# Altium project SoM-STM32F4.PrjPcb
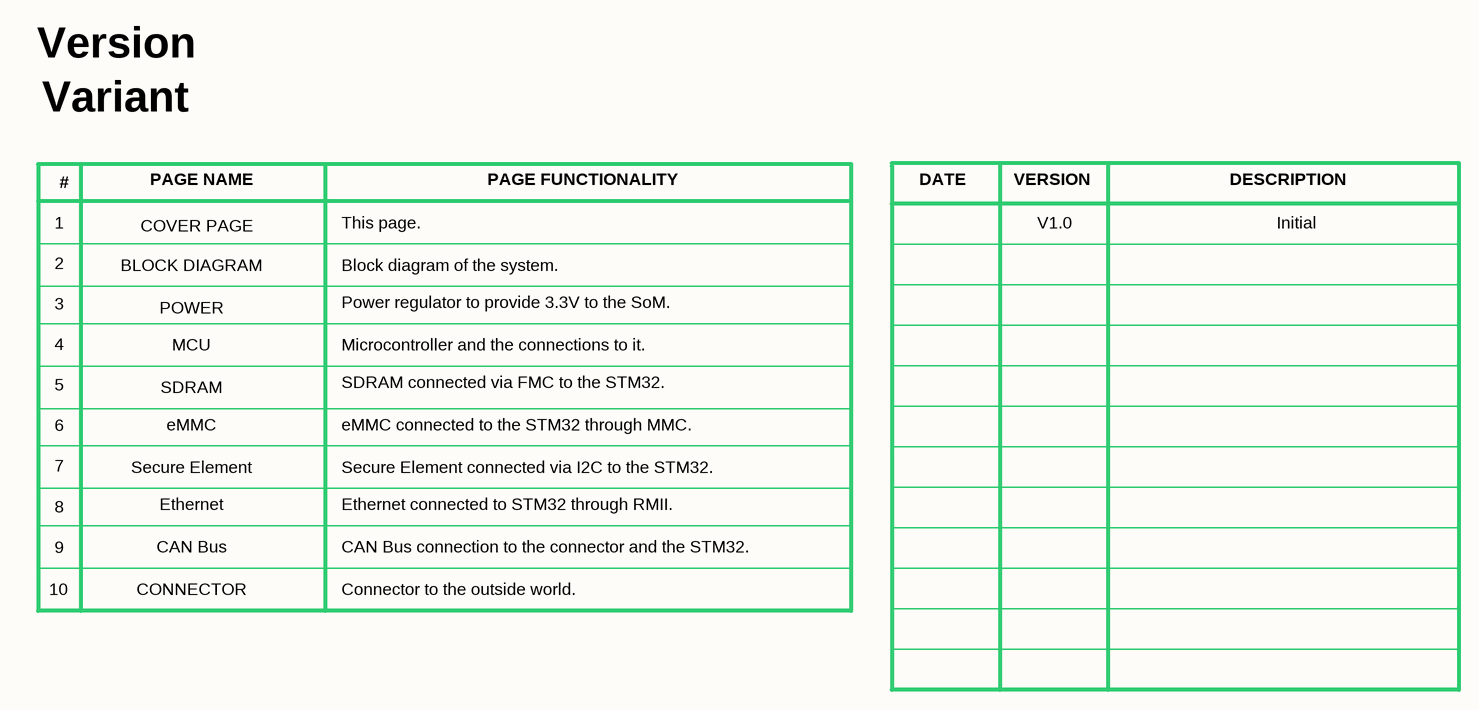
[diagram p0: 01 COVER PAGE.SchDoc]
Engineer_Email: contact@silardgal.com; Engineer_Link: https://www.silardgal.com; Engineer_Name: Silard Gal; Global_version: 1.0
10 sheets, 104 parts. Net scope: flat (ports and power ports of the same name join across sheets).
Board file: SoM-STM32F4.PcbDoc
Sheets:
  01 COVER PAGE.SchDoc
  02 BLOCK DIAGRAM.SchDoc
    U_05 SDRAM = 05 SDRAM.SchDoc
    U_06 eMMC = 06 eMMC.SchDoc
    U_07 Secure Element = 07 Secure Element.SchDoc
    U_9 CAN Bus = 09 CAN Bus.SchDoc
    U_08 Ethernet = 08 Ethernet.SchDoc
    U_04 MCU = 04 MCU.SchDoc
    U_10 CONNECTOR = 10 CONNECTOR.SchDoc
  03 POWER.SchDoc

## Sheet 01 COVER PAGE.SchDoc: COVER PAGE
size 420 x 297 mm; SheetNumber: 1; SheetTotal: 10

### Notes on the sheet
- Version
- Variant
- 1
- #
- PAGE NAME
- COVER PAGE
- This page.
- PAGE FUNCTIONALITY
- DATE
- VERSION
- V1.0
- DESCRIPTION
- Initial
- 2
- BLOCK DIAGRAM
- POWER
- Block diagram of the system.
- Power regulator to provide 3.3V to the SoM.
- 3
- 4
- MCU
- Microcontroller and the connections to it.
- 5
- 6
- SDRAM
- eMMC
- SDRAM connected via FMC to the STM32.
- eMMC connected to the STM32 through MMC.
- 7
- Secure Element
- Ethernet
- Secure Element connected via I2C to the STM32.
- Ethernet connected to STM32 through RMII.
- 8
- 9
- CAN Bus
- CAN Bus connection to the connector and the STM32.
- 10
- CONNECTOR
- Connector to the outside world.
- Title
- Project
- Size
- Date
- Revision
- A3
- Designed By

## Sheet 02 BLOCK DIAGRAM.SchDoc: BLOCK DIAGRAM
size 420 x 297 mm; SheetNumber: 2; SheetTotal: 10
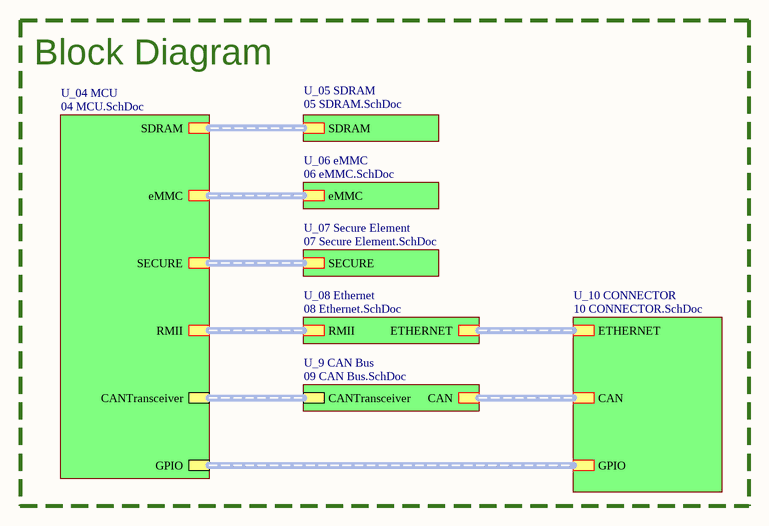
[diagram p1: 02 BLOCK DIAGRAM.SchDoc]

### Sub-sheets
U_04 MCU = 04 MCU.SchDoc: SDRAM (harness SDRAM), eMMC (harness eMMC), SECURE (harness SECURE ELEMENT), RMII (harness RMII), CANTransceiver (harness CAN), GPIO (harness GPIO)
U_05 SDRAM = 05 SDRAM.SchDoc: SDRAM (harness SDRAM)
U_06 eMMC = 06 eMMC.SchDoc: eMMC (harness eMMC)
U_07 Secure Element = 07 Secure Element.SchDoc: SECURE (harness SECURE ELEMENT)
U_08 Ethernet = 08 Ethernet.SchDoc: ETHERNET (harness ETHERNET), RMII (harness RMII)
U_9 CAN Bus = 09 CAN Bus.SchDoc: CAN (harness CAN Bus), CANTransceiver (harness CAN)
U_10 CONNECTOR = 10 CONNECTOR.SchDoc: ETHERNET (harness ETHERNET), CAN (harness CAN Bus), GPIO (harness GPIO)

### Buses and harness runs
harness sheet U_04 MCU/CANTransceiver = sheet U_9 CAN Bus/CANTransceiver
harness sheet U_04 MCU/eMMC = sheet U_06 eMMC/eMMC
harness sheet U_04 MCU/GPIO = sheet U_10 CONNECTOR/GPIO
harness sheet U_04 MCU/RMII = sheet U_08 Ethernet/RMII
harness sheet U_04 MCU/SDRAM = sheet U_05 SDRAM/SDRAM
harness sheet U_04 MCU/SECURE = sheet U_07 Secure Element/SECURE
harness sheet U_08 Ethernet/ETHERNET = sheet U_10 CONNECTOR/ETHERNET
harness sheet U_9 CAN Bus/CAN = sheet U_10 CONNECTOR/CAN

### Notes on the sheet
- Block Diagram
- Title
- Project
- Size
- Date
- Revision
- A3
- Designed By

## Sheet 05 SDRAM.SchDoc: SDRAM
size 420 x 297 mm; SheetNumber: 4; SheetTotal: 10
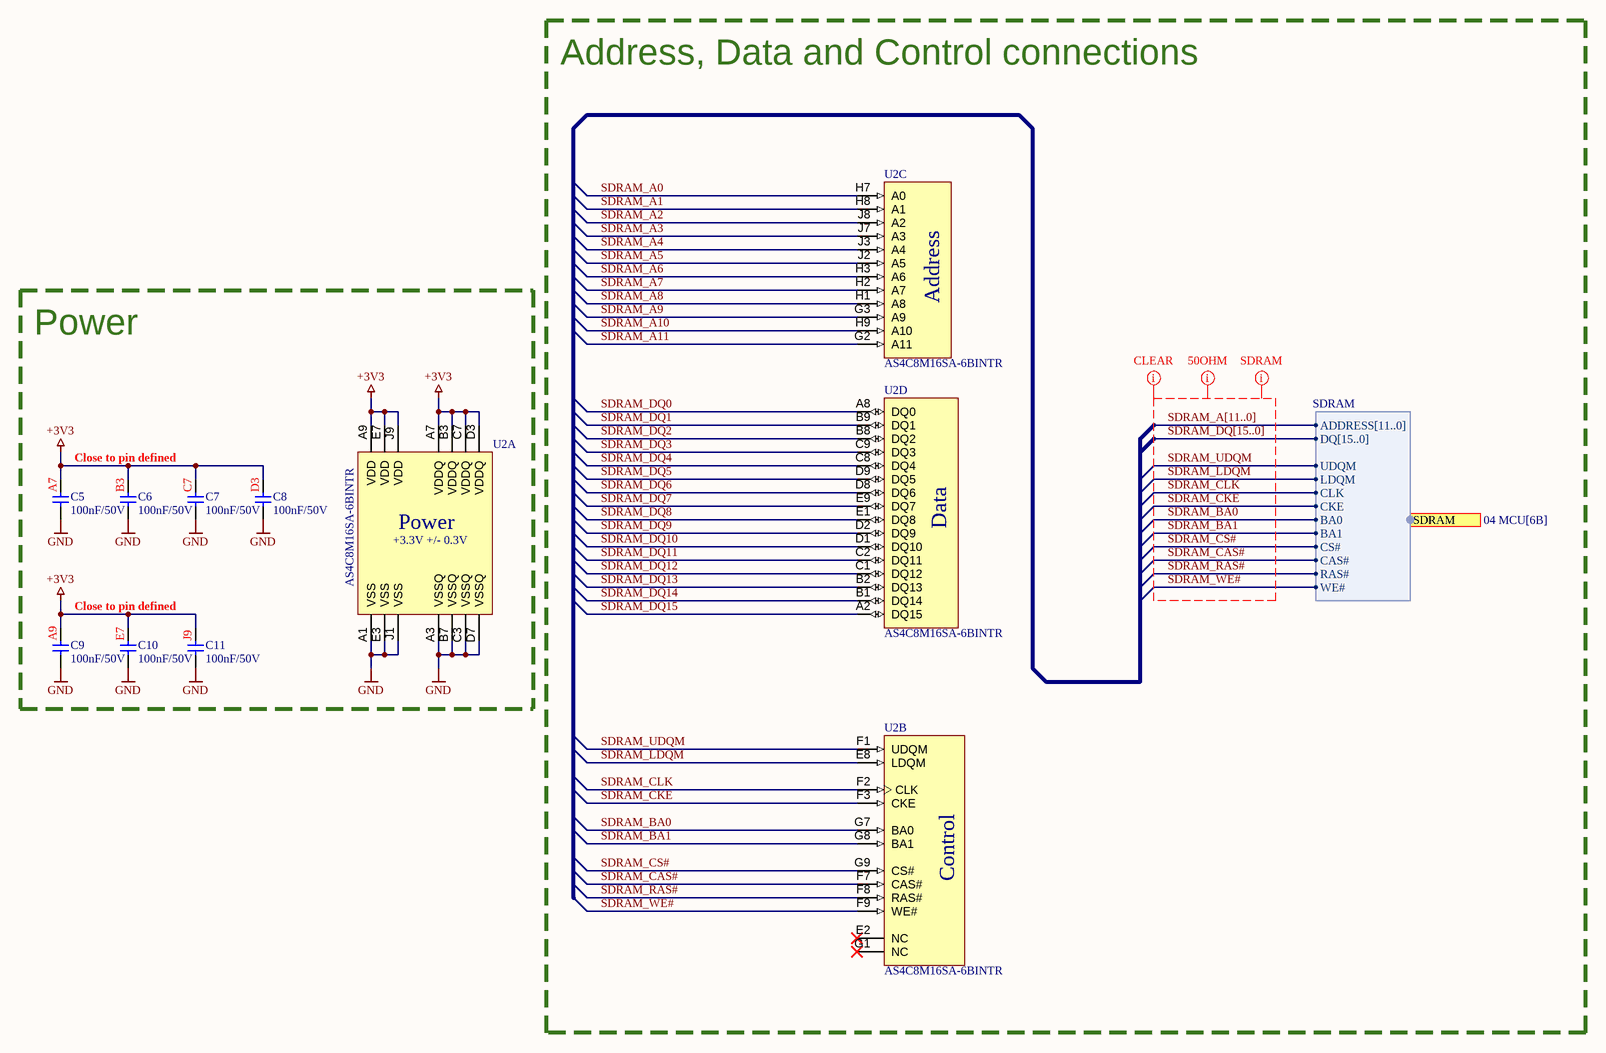
[diagram p2: 05 SDRAM.SchDoc]

### Parts
C5  100nF/50V  [CAPC1005X06M-0402]
C6  100nF/50V  [CAPC1005X06M-0402]
C7  100nF/50V  [CAPC1005X06M-0402]
C8  100nF/50V  [CAPC1005X06M-0402]
C9  100nF/50V  [CAPC1005X06M-0402]
C10  100nF/50V  [CAPC1005X06M-0402]
C11  100nF/50V  [CAPC1005X06M-0402]
U2  AS4C8M16SA-6BINTR  [TFBGA-54]  (parts A,B,C,D of 4)

### Blocks framed on the sheet
Address, Data and Control connections: U2
Power: C5-C11 U2

### Ports
SDRAM (harness SDRAM, see 04 MCU[6B])

### Harnesses
SDRAM: ADDRESS[11..0], DQ[15..0], UDQM, LDQM, CLK, CKE, BA0, BA1, CS#, CAS#, RAS#, WE#

### Nets
+3V3: C5.2 C6.2 C7.2 C8.2 C9.2 C10.2 C11.2 U2.A7(VDDQ) U2.A9(VDD) U2.B3(VDDQ) U2.C7(VDDQ) U2.D3(VDDQ) U2.E7(VDD) U2.J9(VDD)
GND: C5.1 C6.1 C7.1 C8.1 C9.1 C10.1 C11.1 U2.A1(VSS) U2.A3(VSSQ) U2.B7(VSSQ) U2.C3(VSSQ) U2.D7(VSSQ) U2.E3(VSS) U2.J1(VSS)
SDRAM_A0: U2.H7(A0)  [project net FMC_A0]
SDRAM_A1: U2.H8(A1)  [project net FMC_A1]
SDRAM_A2: U2.J8(A2)  [project net FMC_A2]
SDRAM_A3: U2.J7(A3)  [project net FMC_A3]
SDRAM_A4: U2.J3(A4)  [project net FMC_A4]
SDRAM_A5: U2.J2(A5)  [project net FMC_A5]
SDRAM_A6: U2.H3(A6)  [project net FMC_A6]
SDRAM_A7: U2.H2(A7)  [project net FMC_A7]
SDRAM_A8: U2.H1(A8)  [project net FMC_A8]
SDRAM_A9: U2.G3(A9)  [project net FMC_A9]
SDRAM_A10: U2.H9(A10)  [project net FMC_A10]
SDRAM_A11: U2.G2(A11)  [project net FMC_A11]
SDRAM_BA0: U2.G7(BA0) ; port SDRAM.BA0  [project net FMC_A14]
SDRAM_BA1: U2.G8(BA1) ; port SDRAM.BA1  [project net FMC_A15]
SDRAM_CAS#: U2.F7(CAS#) ; port SDRAM.CAS#  [project net FMC_SDNCAS]
SDRAM_CKE: U2.F3(CKE) ; port SDRAM.CKE  [project net FMC_SDCKE0]
SDRAM_CLK: U2.F2(CLK) ; port SDRAM.CLK  [project net FMC_SDCLK]
SDRAM_CS#: U2.G9(CS#) ; port SDRAM.CS#  [project net FMC_SDNE0]
SDRAM_DQ0: U2.A8(DQ0)  [project net FMC_D0]
SDRAM_DQ1: U2.B9(DQ1)  [project net FMC_D1]
SDRAM_DQ2: U2.B8(DQ2)  [project net FMC_D2]
SDRAM_DQ3: U2.C9(DQ3)  [project net FMC_D3]
SDRAM_DQ4: U2.C8(DQ4)  [project net FMC_D4]
SDRAM_DQ5: U2.D9(DQ5)  [project net FMC_D5]
SDRAM_DQ6: U2.D8(DQ6)  [project net FMC_D6]
SDRAM_DQ7: U2.E9(DQ7)  [project net FMC_D7]
SDRAM_DQ8: U2.E1(DQ8)  [project net FMC_D8]
SDRAM_DQ9: U2.D2(DQ9)  [project net FMC_D9]
SDRAM_DQ10: U2.D1(DQ10)  [project net FMC_D10]
SDRAM_DQ11: U2.C2(DQ11)  [project net FMC_D11]
SDRAM_DQ12: U2.C1(DQ12)  [project net FMC_D12]
SDRAM_DQ13: U2.B2(DQ13)  [project net FMC_D13]
SDRAM_DQ14: U2.B1(DQ14)  [project net FMC_D14]
SDRAM_DQ15: U2.A2(DQ15)  [project net FMC_D15]
SDRAM_LDQM: U2.E8(LDQM) ; port SDRAM.LDQM  [project net FMC_NBL0]
SDRAM_RAS#: U2.F8(RAS#) ; port SDRAM.RAS#  [project net FMC_SDNRAS]
SDRAM_UDQM: U2.F1(UDQM) ; port SDRAM.UDQM  [project net FMC_NBL1]
SDRAM_WE#: U2.F9(WE#) ; port SDRAM.WE#  [project net FMC_SDNWE]

Not connected (* = marked no-connect by the designer): U2 E2(NC)* G1(NC)*

### Buses and harness runs
bus SDRAM_A[11..0]
bus SDRAM_DQ[15..0]

### Layout directives
net class SDRAM: SDRAM_A[11..0], SDRAM_BA0, SDRAM_BA1, SDRAM_CAS#, SDRAM_CKE, SDRAM_CLK, SDRAM_CS#, SDRAM_DQ[15..0], SDRAM_LDQM, SDRAM_RAS#, SDRAM_UDQM, SDRAM_WE#
net class 50OHM: SDRAM_A[11..0], SDRAM_BA0, SDRAM_BA1, SDRAM_CAS#, SDRAM_CKE, SDRAM_CLK, SDRAM_CS#, SDRAM_DQ[15..0], SDRAM_LDQM, SDRAM_RAS#, SDRAM_UDQM, SDRAM_WE#
net class CLEAR: SDRAM_A[11..0], SDRAM_BA0, SDRAM_BA1, SDRAM_CAS#, SDRAM_CKE, SDRAM_CLK, SDRAM_CS#, SDRAM_DQ[15..0], SDRAM_LDQM, SDRAM_RAS#, SDRAM_UDQM, SDRAM_WE#

### Notes on the sheet
- (near C5) A7
- Close to pin defined
- (near C6) B3
- (near C7) C7
- (near C8) D3
- (near C9) A9
- (near C10) E7
- (near C11) J9
- Title
- Project
- Size
- Date
- Revision
- A3
- Designed By
- (in symbol AS4C8M16SA-6BINTR, part A) Power; +3.3V +/- 0.3V
- (in symbol AS4C8M16SA-6BINTR, part B) Control
- (in symbol AS4C8M16SA-6BINTR, part C) Address
- (in symbol AS4C8M16SA-6BINTR, part D) Data

### Library data of the parts
C5-C11 = GRM155R71H104KE14D: 0.1 µF ±10% 50V Ceramic Capacitor X7R 0402 (1005 Metric); ComponentLink1Description: Datasheet; ComponentLink1URL: https://search.murata.co.jp/Ceramy/image/img/A01X/G101/ENG/GRM155R60J475ME47-01.pdf; MPN: GRM155R71H104KE14D
U2 = AS4C8M16SA-6BINTR: SDRAM Memory IC 128Mbit Parallel 166 MHz 5 ns 54-TFBGA (8x8); MPN: AS4C8M16SA-6BINTR; ComponentLink1Description: Datasheet; ComponentLink1URL: https://www.alliancememory.com/wp-content/uploads/pdf/dram/128M-AS4C8M16SA.pdf

## Sheet 06 eMMC.SchDoc: eMMC
size 420 x 297 mm; SheetNumber: 6; SheetTotal: 10
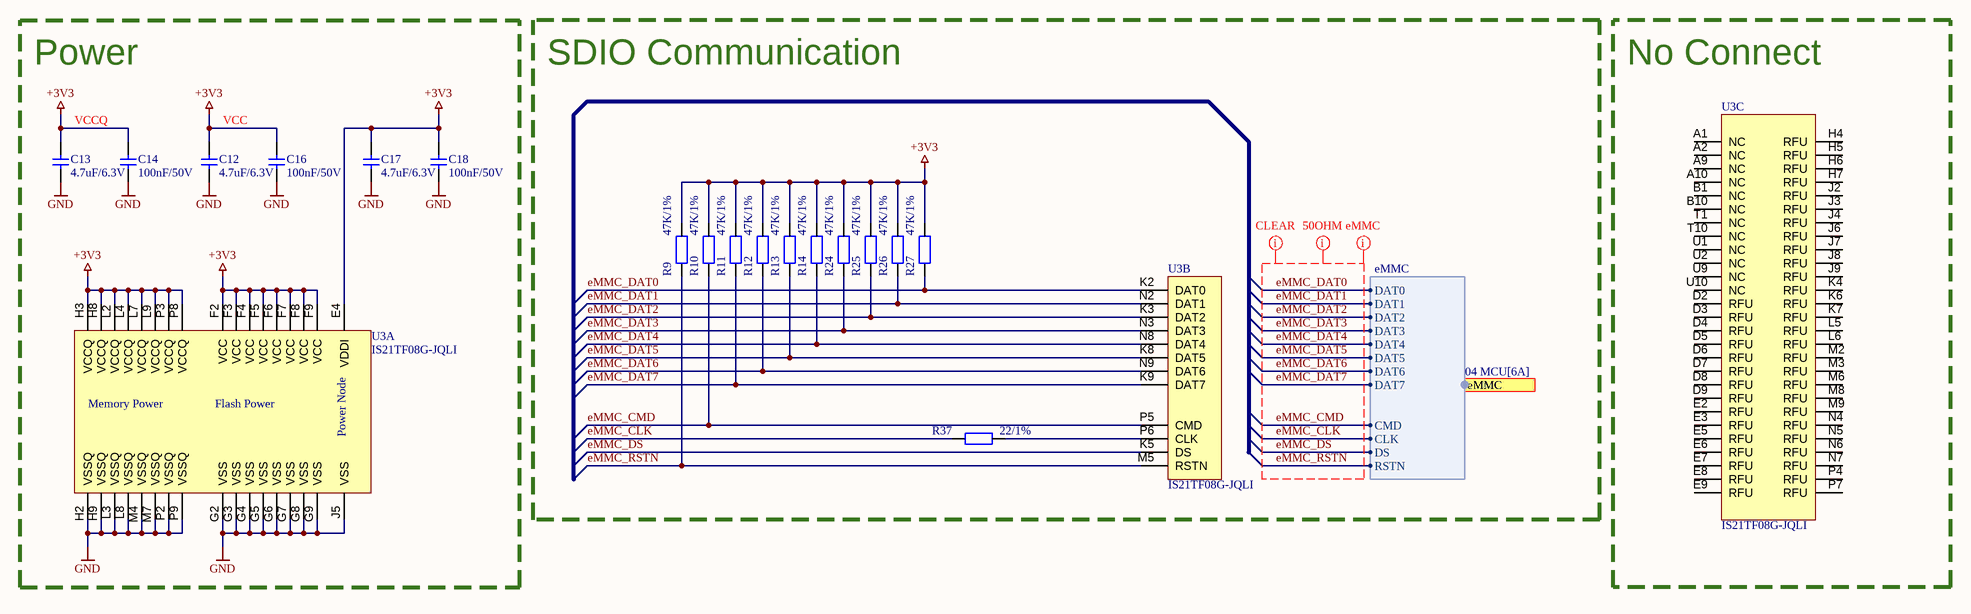
[diagram p3: 06 eMMC.SchDoc]

### Parts
C12  4.7uF/6.3V  [CAPC1005X06M-0402]
C13  4.7uF/6.3V  [CAPC1005X06M-0402]
C14  100nF/50V  [CAPC1005X06M-0402]
C16  100nF/50V  [CAPC1005X06M-0402]
C17  4.7uF/6.3V  [CAPC1005X06M-0402]
C18  100nF/50V  [CAPC1005X06M-0402]
R9  47K/1%  [RESC1005X04M-0402]
R10  47K/1%  [RESC1005X04M-0402]
R11  47K/1%  [RESC1005X04M-0402]
R12  47K/1%  [RESC1005X04M-0402]
R13  47K/1%  [RESC1005X04M-0402]
R14  47K/1%  [RESC1005X04M-0402]
R24  47K/1%  [RESC1005X04M-0402]
R25  47K/1%  [RESC1005X04M-0402]
R26  47K/1%  [RESC1005X04M-0402]
R27  47K/1%  [RESC1005X04M-0402]
R37  22/1%  [RESC1005X04M-0402]
U3  IS21TF08G-JQLI  [BGA180C100P10X18_1400X1400X140]  (parts A,B,C of 3)

### Blocks framed on the sheet
Power: C12-C14 C16-C18 U3
SDIO Communication: R9-R14 R24-R27 R37 U3
No Connect: U3

### Ports
eMMC (harness eMMC, see 04 MCU[6A])

### Harnesses
eMMC: DAT0, DAT1, DAT2, DAT3, DAT4, DAT5, DAT6, DAT7, CMD, CLK, DS, RSTN

### Nets
+3V3: C12.2 C13.2 C14.2 C16.2 C17.2 C18.2 R9.2 R10.2 R11.2 R12.2 R13.2 R14.2 R24.2 R25.2 R26.2 R27.2 U3.E4(VDDI) U3.F2(VCC) U3.F3(VCC) U3.F4(VCC) U3.F5(VCC) U3.F6(VCC) U3.F7(VCC) U3.F8(VCC) U3.F9(VCC) U3.H3(VCCQ) U3.H8(VCCQ) U3.L2(VCCQ) U3.L4(VCCQ) U3.L7(VCCQ) U3.L9(VCCQ) U3.P3(VCCQ) U3.P8(VCCQ)
GND: C12.1 C13.1 C14.1 C16.1 C17.1 C18.1 U3.G2(VSS) U3.G3(VSS) U3.G4(VSS) U3.G5(VSS) U3.G6(VSS) U3.G7(VSS) U3.G8(VSS) U3.G9(VSS) U3.H2(VSSQ) U3.H9(VSSQ) U3.J5(VSS) U3.L3(VSSQ) U3.L8(VSSQ) U3.M4(VSSQ) U3.M7(VSSQ) U3.P2(VSSQ) U3.P9(VSSQ)
eMMC_CLK: R37.1 ; port eMMC.CLK
eMMC_CMD: R10.1 U3.P5(CMD) ; port eMMC.CMD
eMMC_DAT0: R27.1 U3.K2(DAT0) ; port eMMC.DAT0
eMMC_DAT1: R26.1 U3.N2(DAT1) ; port eMMC.DAT1
eMMC_DAT2: R25.1 U3.K3(DAT2) ; port eMMC.DAT2
eMMC_DAT3: R24.1 U3.N3(DAT3) ; port eMMC.DAT3
eMMC_DAT4: R14.1 U3.N8(DAT4) ; port eMMC.DAT4
eMMC_DAT5: R13.1 U3.K8(DAT5) ; port eMMC.DAT5
eMMC_DAT6: R12.1 U3.N9(DAT6) ; port eMMC.DAT6
eMMC_DAT7: R11.1 U3.K9(DAT7) ; port eMMC.DAT7
eMMC_DS: U3.K5(DS) ; port eMMC.DS
eMMC_RSTN: R9.1 U3.M5(RSTN) ; port eMMC.RSTN
NetR37_2: R37.2 U3.P6(CLK)

Not connected (* = marked no-connect by the designer): U3 A1(NC) A2(NC) A9(NC) A10(NC) B1(NC) B10(NC) D2(RFU) D3(RFU) D4(RFU) D5(RFU) D6(RFU) D7(RFU) D8(RFU) D9(RFU) E2(RFU) E3(RFU) E5(RFU) E6(RFU) E7(RFU) E8(RFU) E9(RFU) H4(RFU) H5(RFU) H6(RFU) H7(RFU) J2(RFU) J3(RFU) J4(RFU) J6(RFU) J7(RFU) J8(RFU) J9(RFU) K4(RFU) K6(RFU) K7(RFU) L5(RFU) L6(RFU) M2(RFU) M3(RFU) M6(RFU) M8(RFU) M9(RFU) N4(RFU) N5(RFU) N6(RFU) N7(RFU) P4(RFU) P7(RFU) T1(NC) T10(NC) U1(NC) U2(NC) U9(NC) U10(NC)

### Layout directives
net class eMMC: eMMC_CLK, eMMC_CMD, eMMC_DAT0, eMMC_DAT1, eMMC_DAT2, eMMC_DAT3, eMMC_DAT4, eMMC_DAT5, eMMC_DAT6, eMMC_DAT7, eMMC_DS, eMMC_RSTN
net class 50OHM: eMMC_CLK, eMMC_CMD, eMMC_DAT0, eMMC_DAT1, eMMC_DAT2, eMMC_DAT3, eMMC_DAT4, eMMC_DAT5, eMMC_DAT6, eMMC_DAT7, eMMC_DS, eMMC_RSTN
net class CLEAR: eMMC_CLK, eMMC_CMD, eMMC_DAT0, eMMC_DAT1, eMMC_DAT2, eMMC_DAT3, eMMC_DAT4, eMMC_DAT5, eMMC_DAT6, eMMC_DAT7, eMMC_DS, eMMC_RSTN

### Notes on the sheet
- VCCQ
- VCC
- Title
- Project
- Size
- Date
- Revision
- A3
- Designed By
- (in symbol IS21TF08G-JQLI, part A) Memory Power; Flash Power; Power Node

### Library data of the parts
C12 C13 C17 = GRM155R60J475ME47D: 4.7 µF ±20% 6.3V Ceramic Capacitor X5R 0402 (1005 Metric); ComponentLink1Description: Datasheet; ComponentLink1URL: https://search.murata.co.jp/Ceramy/image/img/A01X/G101/ENG/GRM155R60J475ME47-01.pdf; MPN: GRM155R60J475ME47D
C14 C16 C18 = GRM155R71H104KE14D: as C5 on sheet 05 SDRAM; ComponentLink1Description: Datasheet; ComponentLink1URL: https://search.murata.co.jp/Ceramy/image/img/A01X/G101/ENG/GRM155R60J475ME47-01.pdf; MPN: GRM155R71H104KE14D
R9-R14 R24-R27 = RC0402FR-0747KL: 47 kOhms ±1% 0.063W, 1/16W Chip Resistor 0402 (1005 Metric) Moisture Resistant Thick Film; ComponentLink1Description: Datasheet; ComponentLink1URL: https://www.yageo.com/upload/media/product/productsearch/datasheet/rchip/PYu-RC_Group_51_RoHS_L_12.pdf; MPN: RC0402FR-0747KL
R37 = RC0402FR-0722RL: 22 Ohms ±1% 0.063W, 1/16W Chip Resistor 0402 (1005 Metric) Moisture Resistant Thick Film; ComponentLink1Description: Datasheet; ComponentLink1URL: https://www.yageo.com/upload/media/product/productsearch/datasheet/rchip/PYu-RC_Group_51_RoHS_L_12.pdf; MPN: RC0402FR-0722RL
U3 = IS21TF08G-JQLI: FLASH - NAND (TLC) Memory IC 64Gbit MMC 200 MHz 100-LFBGA (14x18); ComponentLink1Description: Datasheet; ComponentLink1URL: https://www.issi.com/WW/pdf/21-22TF08G.pdf; MPN: IS21TF08G-JQLI

## Sheet 07 Secure Element.SchDoc: Secure Element
size 420 x 297 mm; SheetNumber: 7; SheetTotal: 10
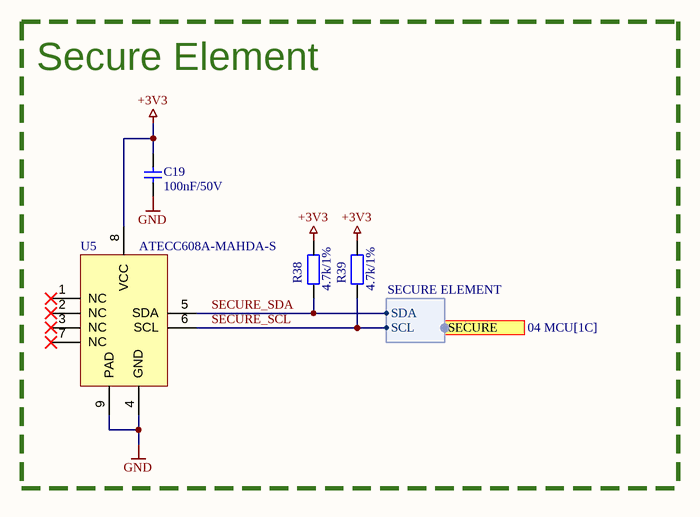
[diagram p4: 07 Secure Element.SchDoc]

### Parts
C19  100nF/50V  [CAPC1005X06M-0402]
R38  4.7k/1%  [RESC1005X04M-0402]
R39  4.7k/1%  [RESC1005X04M-0402]
U5  ATECC608A-MAHDA-S  [SON50P200X60_HS-9N]

### Blocks framed on the sheet
Secure Element: C19 R38 R39 U5

### Ports
SECURE (harness SECURE ELEMENT, see 04 MCU[1C])

### Harnesses
SECURE ELEMENT: SDA, SCL

### Nets
+3V3: C19.2 R38.2 R39.2 U5.8(VCC)
GND: C19.1 U5.4(GND) U5.9(PAD)
SECURE_SCL: R39.1 U5.6(SCL) ; port SECURE.SCL  [project net I2C1_SCL]
SECURE_SDA: R38.1 U5.5(SDA) ; port SECURE.SDA  [project net I2C1_SDA]

Not connected (* = marked no-connect by the designer): U5 1(NC)* 2(NC)* 3(NC)* 7(NC)*

### Notes on the sheet
- Title
- Project
- Size
- Date
- Revision
- A3
- Designed By

### Library data of the parts
C19 = GRM155R71H104KE14D: as C5 on sheet 05 SDRAM; ComponentLink1Description: Datasheet; ComponentLink1URL: https://search.murata.co.jp/Ceramy/image/img/A01X/G101/ENG/GRM155R60J475ME47-01.pdf; MPN: GRM155R71H104KE14D
R38 R39 = RC0402FR-074K7L: 4.7 kOhms ±1% 0.063W, 1/16W Chip Resistor 0402 (1005 Metric) Moisture Resistant Thick Film; ComponentLink1Description: Datasheet; ComponentLink1URL: https://www.yageo.com/upload/media/product/productsearch/datasheet/rchip/PYu-RC_Group_51_RoHS_L_12.pdf; MPN: RC0402FR-074K7L
U5 = ATECC608A-MAHDA-S: Authentication Chip 8-UDFN (2x3); MPN: ATECC608A-MAHDA-S; ComponentLink1Description: Datasheet; ComponentLink1URL: https://ww1.microchip.com/downloads/en/DeviceDoc/ATECC608A-CryptoAuthentication-Device-Summary-Data-Sheet-DS40001977B.pdf

## Sheet 09 CAN Bus.SchDoc: CAN Bus
size 420 x 297 mm; SheetNumber: 9; SheetTotal: 10
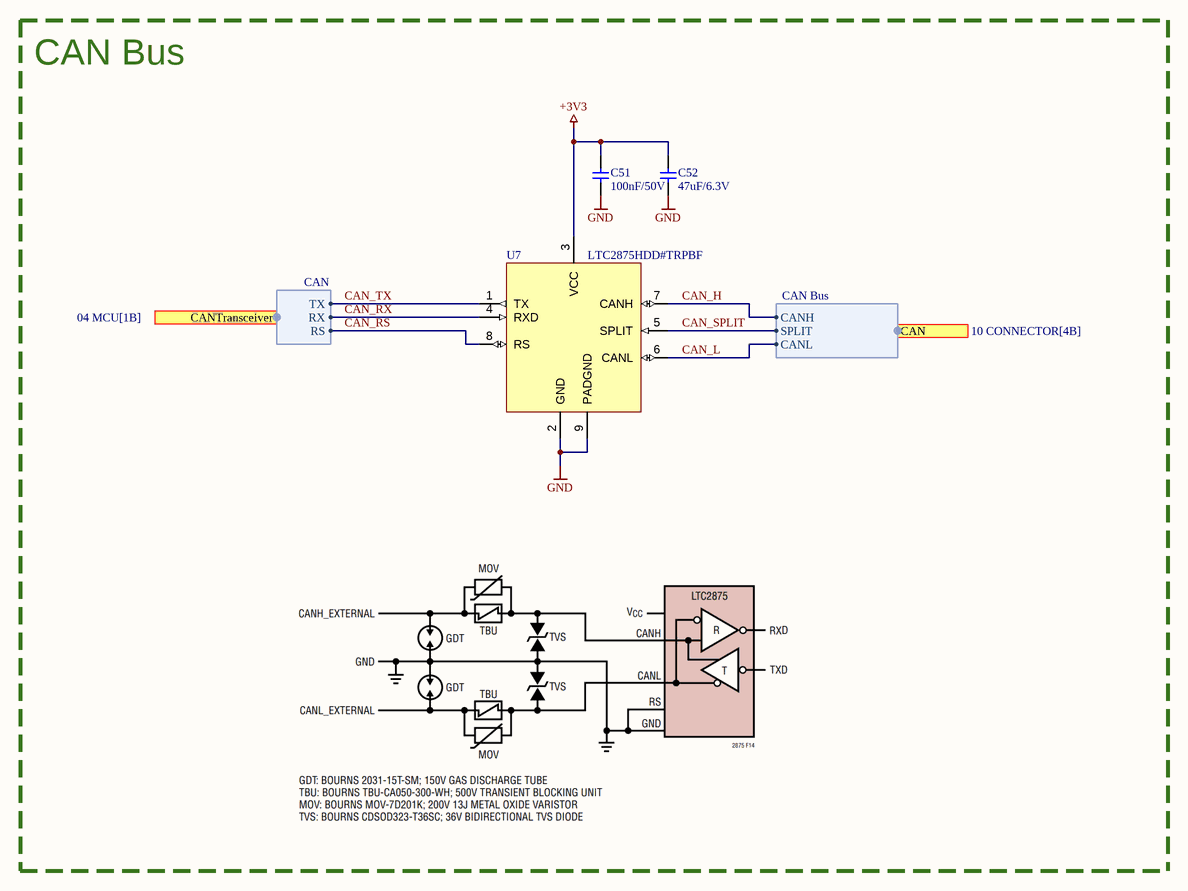
[diagram p5: 09 CAN Bus.SchDoc]

### Parts
C51  100nF/50V  [CAPC1005X06M-0402]
C52  47uF/6.3V  [CAPC1608X10M-0603]
U7  LTC2875HDD#TRPBF  [DFN-8]

### Blocks framed on the sheet
CAN Bus: C51 C52 U7

### Ports
CAN (harness CAN Bus, see 10 CONNECTOR[4B]), CANTransceiver (harness CAN, see 04 MCU[1B])

### Harnesses
CAN Bus: CANH, CANL, SPLIT
CAN: TX, RX, RS

### Nets
+3V3: C51.2 C52.2 U7.3(VCC)
GND: C51.1 C52.1 U7.2(GND) U7.9(PADGND)
CAN_H: U7.7(CANH) ; port CAN.CANH
CAN_L: U7.6(CANL) ; port CAN.CANL
CAN_RS: U7.8(RS) ; port CANTransceiver.RS
CAN_RX: U7.4(RXD) ; port CANTransceiver.RX  [project net CAN1_RX]
CAN_SPLIT: U7.5(SPLIT) ; port CAN.SPLIT
CAN_TX: U7.1(TX) ; port CANTransceiver.TX  [project net CAN1_TX]

### Notes on the sheet
- Title
- Project
- Size
- Date
- Revision
- A3
- Designed By

### Library data of the parts
C51 = GRM155R71H104KE14D: as C5 on sheet 05 SDRAM; ComponentLink1Description: Datasheet; ComponentLink1URL: https://search.murata.co.jp/Ceramy/image/img/A01X/G101/ENG/GRM155R60J475ME47-01.pdf; MPN: GRM155R71H104KE14D
C52 = GRM188R60J476ME15D: 47 µF ±20% 6.3V Ceramic Capacitor X5R 0603 (1608 Metric); ComponentLink1Description: Datasheet; ComponentLink1URL: https://search.murata.co.jp/Ceramy/image/img/A01X/G101/ENG/GRM188R60J476ME15-01.pdf; MPN: GRM188R60J476ME15D
U7 = LTC2875HDD#TRPBF: 1/1 Transceiver CANbus 8-DFN (3x3); MPN: LTC2875HDD#TRPBF; ComponentLink1Description: Datasheet; ComponentLink1URL: https://www.analog.com/media/en/technical-documentation/data-sheets/LTC2875.pdf

## Sheet 08 Ethernet.SchDoc: Ethernet
size 420 x 297 mm; SheetNumber: 7; SheetTotal: 10
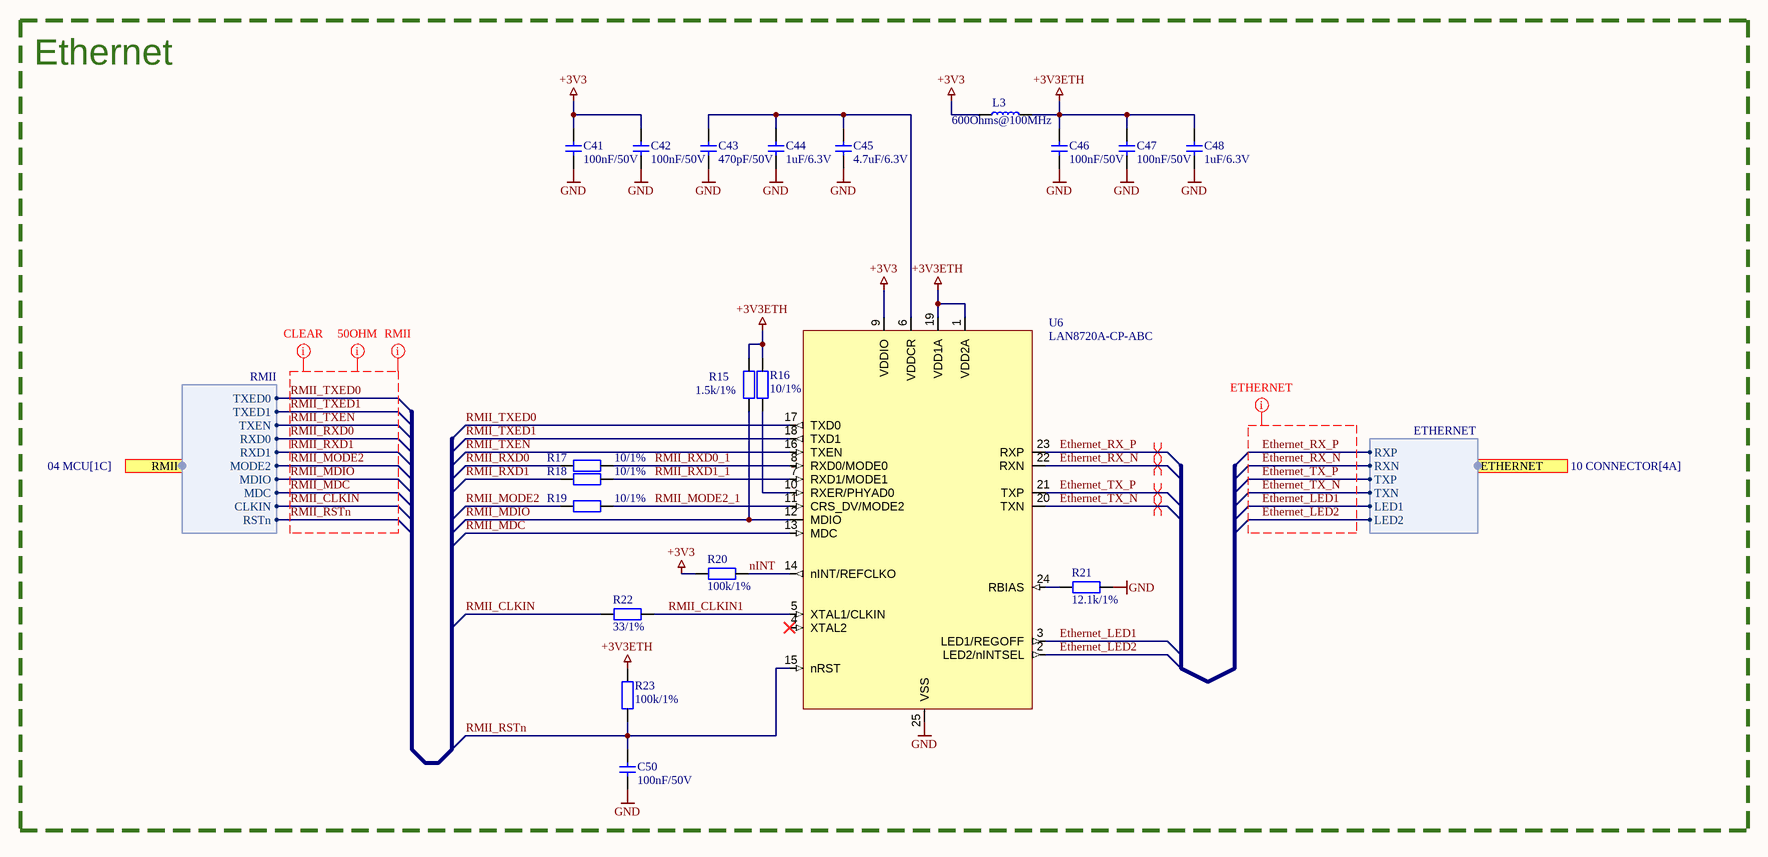
[diagram p6: 08 Ethernet.SchDoc]

### Parts
C41  100nF/50V  [CAPC1005X06M-0402]
C42  100nF/50V  [CAPC1005X06M-0402]
C43  470pF/50V  [CAPC1005X06M-0402]
C44  1uF/6.3V  [CAPC1005X06M-0402]
C45  4.7uF/6.3V  [CAPC1005X06M-0402]
C46  100nF/50V  [CAPC1005X06M-0402]
C47  100nF/50V  [CAPC1005X06M-0402]
C48  1uF/6.3V  [CAPC1005X06M-0402]
C50  100nF/50V  [CAPC1005X06M-0402]
L3  600Ohms@100MHz  [INDC1005X06M-0402]
R15  1.5k/1%  [RESC1005X04M-0402]
R16  10/1%  [RESC1005X04M-0402]
R17  10/1%  [RESC1005X04M-0402]
R18  10/1%  [RESC1005X04M-0402]
R19  10/1%  [RESC1005X04M-0402]
R20  100k/1%  [RESC1005X04M-0402]
R21  12.1k/1%  [RESC1005X04M-0402]
R22  33/1%  [RESC1005X04M-0402]
R23  100k/1%  [RESC1005X04M-0402]
U6  LAN8720A-CP-ABC  [QFN24P50_40X40X85L40X25]

### Blocks framed on the sheet
Ethernet: C41-C48 C50 L3 R15-R23 U6

### Ports
ETHERNET (harness ETHERNET, see 10 CONNECTOR[4A]), RMII (harness RMII, see 04 MCU[1C])

### Harnesses
ETHERNET: RXP, RXN, TXP, TXN, LED1, LED2
RMII: TXED0, TXED1, TXEN, RXD0, RXD1, MODE2, MDIO, MDC, CLKIN, RSTn

### Nets
+3V3: C41.2 C42.2 L3.1 R20.1 U6.9(VDDIO)
+3V3ETH: C46.2 C47.2 C48.2 L3.2 R15.2 R16.2 R23.1 U6.1(VDD2A) U6.19(VDD1A)
GND: C41.1 C42.1 C43.1 C44.1 C45.1 C46.1 C47.1 C48.1 C50.1 R21.2 U6.25(VSS)
Ethernet_LED1: U6.3(LED1/REGOFF) ; port ETHERNET.LED1
Ethernet_LED2: U6.2(LED2/nINTSEL) ; port ETHERNET.LED2
Ethernet_RX_N: U6.22(RXN) ; port ETHERNET.RXN
Ethernet_RX_P: U6.23(RXP) ; port ETHERNET.RXP
Ethernet_TX_N: U6.20(TXN) ; port ETHERNET.TXN
Ethernet_TX_P: U6.21(TXP) ; port ETHERNET.TXP
nINT: R20.2 U6.14(nINT/REFCLKO)
RMII_CLKIN: R22.1 ; port RMII.CLKIN  [project net ETH_REF_CLK]
RMII_CLKIN1: R22.2 U6.5(XTAL1/CLKIN)
RMII_MDC: U6.13(MDC) ; port RMII.MDC  [project net ETH_MDC]
RMII_MDIO: R15.1 U6.12(MDIO) ; port RMII.MDIO  [project net ETH_MDIO]
RMII_MODE2: R19.1 ; port RMII.MODE2  [project net ETH_CRS_DV]
RMII_MODE2_1: R19.2 U6.11(CRS_DV/MODE2)
RMII_RSTn: C50.2 R23.2 U6.15(nRST) ; port RMII.RSTn
RMII_RXD0: R17.1 ; port RMII.RXD0  [project net ETH_RXD0]
RMII_RXD0_1: R17.2 U6.8(RXD0/MODE0)
RMII_RXD1: R18.1 ; port RMII.RXD1  [project net ETH_RXD1]
RMII_RXD1_1: R18.2 U6.7(RXD1/MODE1)
RMII_TXED0: U6.17(TXD0) ; port RMII.TXED0  [project net ETH_TXD0]
RMII_TXED1: U6.18(TXD1) ; port RMII.TXED1  [project net ETH_TXD1]
RMII_TXEN: U6.16(TXEN) ; port RMII.TXEN  [project net ETH_TX_EN]
NetC43_2: C43.2 C44.2 C45.2 U6.6(VDDCR)
NetR16_1: R16.1 U6.10(RXER/PHYAD0)
NetR21_1: R21.1 U6.24(RBIAS)

Not connected (* = marked no-connect by the designer): U6 4(XTAL2)*

### Layout directives
net class RMII: RMII_CLKIN, RMII_MDC, RMII_MDIO, RMII_MODE2, RMII_RSTn, RMII_RXD0, RMII_RXD1, RMII_TXED0, RMII_TXED1, RMII_TXEN
net class 50OHM: RMII_CLKIN, RMII_MDC, RMII_MDIO, RMII_MODE2, RMII_RSTn, RMII_RXD0, RMII_RXD1, RMII_TXED0, RMII_TXED1, RMII_TXEN
differential pair; differential pair class ETH_RX: Ethernet_RX_N, Ethernet_RX_P
differential pair; differential pair class ETH_TX: Ethernet_TX_N, Ethernet_TX_P
net class ETHERNET: Ethernet_LED1, Ethernet_LED2, Ethernet_RX_N, Ethernet_RX_P, Ethernet_TX_N, Ethernet_TX_P
net class CLEAR: RMII_CLKIN, RMII_MDC, RMII_MDIO, RMII_MODE2, RMII_RSTn, RMII_RXD0, RMII_RXD1, RMII_TXED0, RMII_TXED1, RMII_TXEN

### Notes on the sheet
- Title
- Project
- Size
- Date
- Revision
- A3
- Designed By

### Library data of the parts
C41 C42 C46 C47 C50 = GRM155R71H104KE14D: as C5 on sheet 05 SDRAM; ComponentLink1Description: Datasheet; ComponentLink1URL: https://search.murata.co.jp/Ceramy/image/img/A01X/G101/ENG/GRM155R60J475ME47-01.pdf; MPN: GRM155R71H104KE14D
C43 = GRM155R71H471KA01D: 470 pF ±10% 50V Ceramic Capacitor X7R 0402 (1005 Metric); ComponentLink1Description: Datasheet; ComponentLink1URL: https://search.murata.co.jp/Ceramy/image/img/A01X/G101/ENG/GRM155R60J475ME47-01.pdf; MPN: GRM155R71H471KA01D
C44 C48 = GRM155R70J105KA12J: 1 µF ±10% 6.3V Ceramic Capacitor X7R 0402 (1005 Metric); ComponentLink1Description: Datasheet; ComponentLink1URL: https://search.murata.co.jp/Ceramy/image/img/A01X/G101/ENG/GRM155R60J475ME47-01.pdf; MPN: GRM155R70J105KA12J
C45 = GRM155R60J475ME47D: as C12 on sheet 06 eMMC; ComponentLink1Description: Datasheet; ComponentLink1URL: https://search.murata.co.jp/Ceramy/image/img/A01X/G101/ENG/GRM155R60J475ME47-01.pdf; MPN: GRM155R60J475ME47D
L3 = BLM15AG601SN1D: 600 Ohms @ 100 MHz 1 Ferrite Bead 0402 (1005 Metric) 300mA 520mOhm; ComponentLink1Description: Datasheet; ComponentLink1URL: https://www.murata.com/en-us/products/productdata/8796740059166/ENFA0018.pdf; MPN: BLM15AG601SN1D
R15 = RC0402FR-071K5L: 1.5 kOhms ±1% 0.063W, 1/16W Chip Resistor 0402 (1005 Metric) Moisture Resistant Thick Film; ComponentLink1Description: Datasheet; ComponentLink1URL: https://www.yageo.com/upload/media/product/productsearch/datasheet/rchip/PYu-RC_Group_51_RoHS_L_12.pdf; MPN: RC0402FR-071K5L
R16-R19 = RC0402FR-0710RL: 10 Ohms ±1% 0.063W, 1/16W Chip Resistor 0402 (1005 Metric) Moisture Resistant Thick Film; ComponentLink1Description: Datasheet; ComponentLink1URL: https://www.yageo.com/upload/media/product/productsearch/datasheet/rchip/PYu-RC_Group_51_RoHS_L_12.pdf; MPN: RC0402FR-0710RL
R20 R23 = RC0402FR-07100KL: 100 kOhms ±1% 0.063W, 1/16W Chip Resistor 0402 (1005 Metric) Moisture Resistant Thick Film; ComponentLink1Description: Datasheet; ComponentLink1URL: https://www.yageo.com/upload/media/product/productsearch/datasheet/rchip/PYu-RC_Group_51_RoHS_L_12.pdf; MPN: RC0402FR-07100KL
R21 = RC0402FR-0712K1L: 12.1 kOhms ±1% 0.063W, 1/16W Chip Resistor 0402 (1005 Metric) Moisture Resistant Thick Film; ComponentLink1Description: Datasheet; ComponentLink1URL: https://www.yageo.com/upload/media/product/productsearch/datasheet/rchip/PYu-RC_Group_51_RoHS_L_12.pdf; MPN: RC0402FR-0712K1L
R22 = RC0402FR-0733RL: 33 Ohms ±1% 0.063W, 1/16W Chip Resistor 0402 (1005 Metric) Moisture Resistant Thick Film; ComponentLink1Description: Datasheet; ComponentLink1URL: https://www.yageo.com/upload/media/product/productsearch/datasheet/rchip/PYu-RC_Group_51_RoHS_L_12.pdf; MPN: RC0402FR-0733RL
U6 = LAN8720A: 2/2 Transceiver Full RMII 24-SQFN (4x4); MPN: LAN8720A-CP-ABC; ComponentLink1Description: Datasheet; ComponentLink1URL: https://ww1.microchip.com/downloads/aemDocuments/documents/OTH/ProductDocuments/DataSheets/00002165B.pdf

## Sheet 04 MCU.SchDoc: MCU
size 420 x 297 mm; SheetNumber: 3; SheetTotal: 10
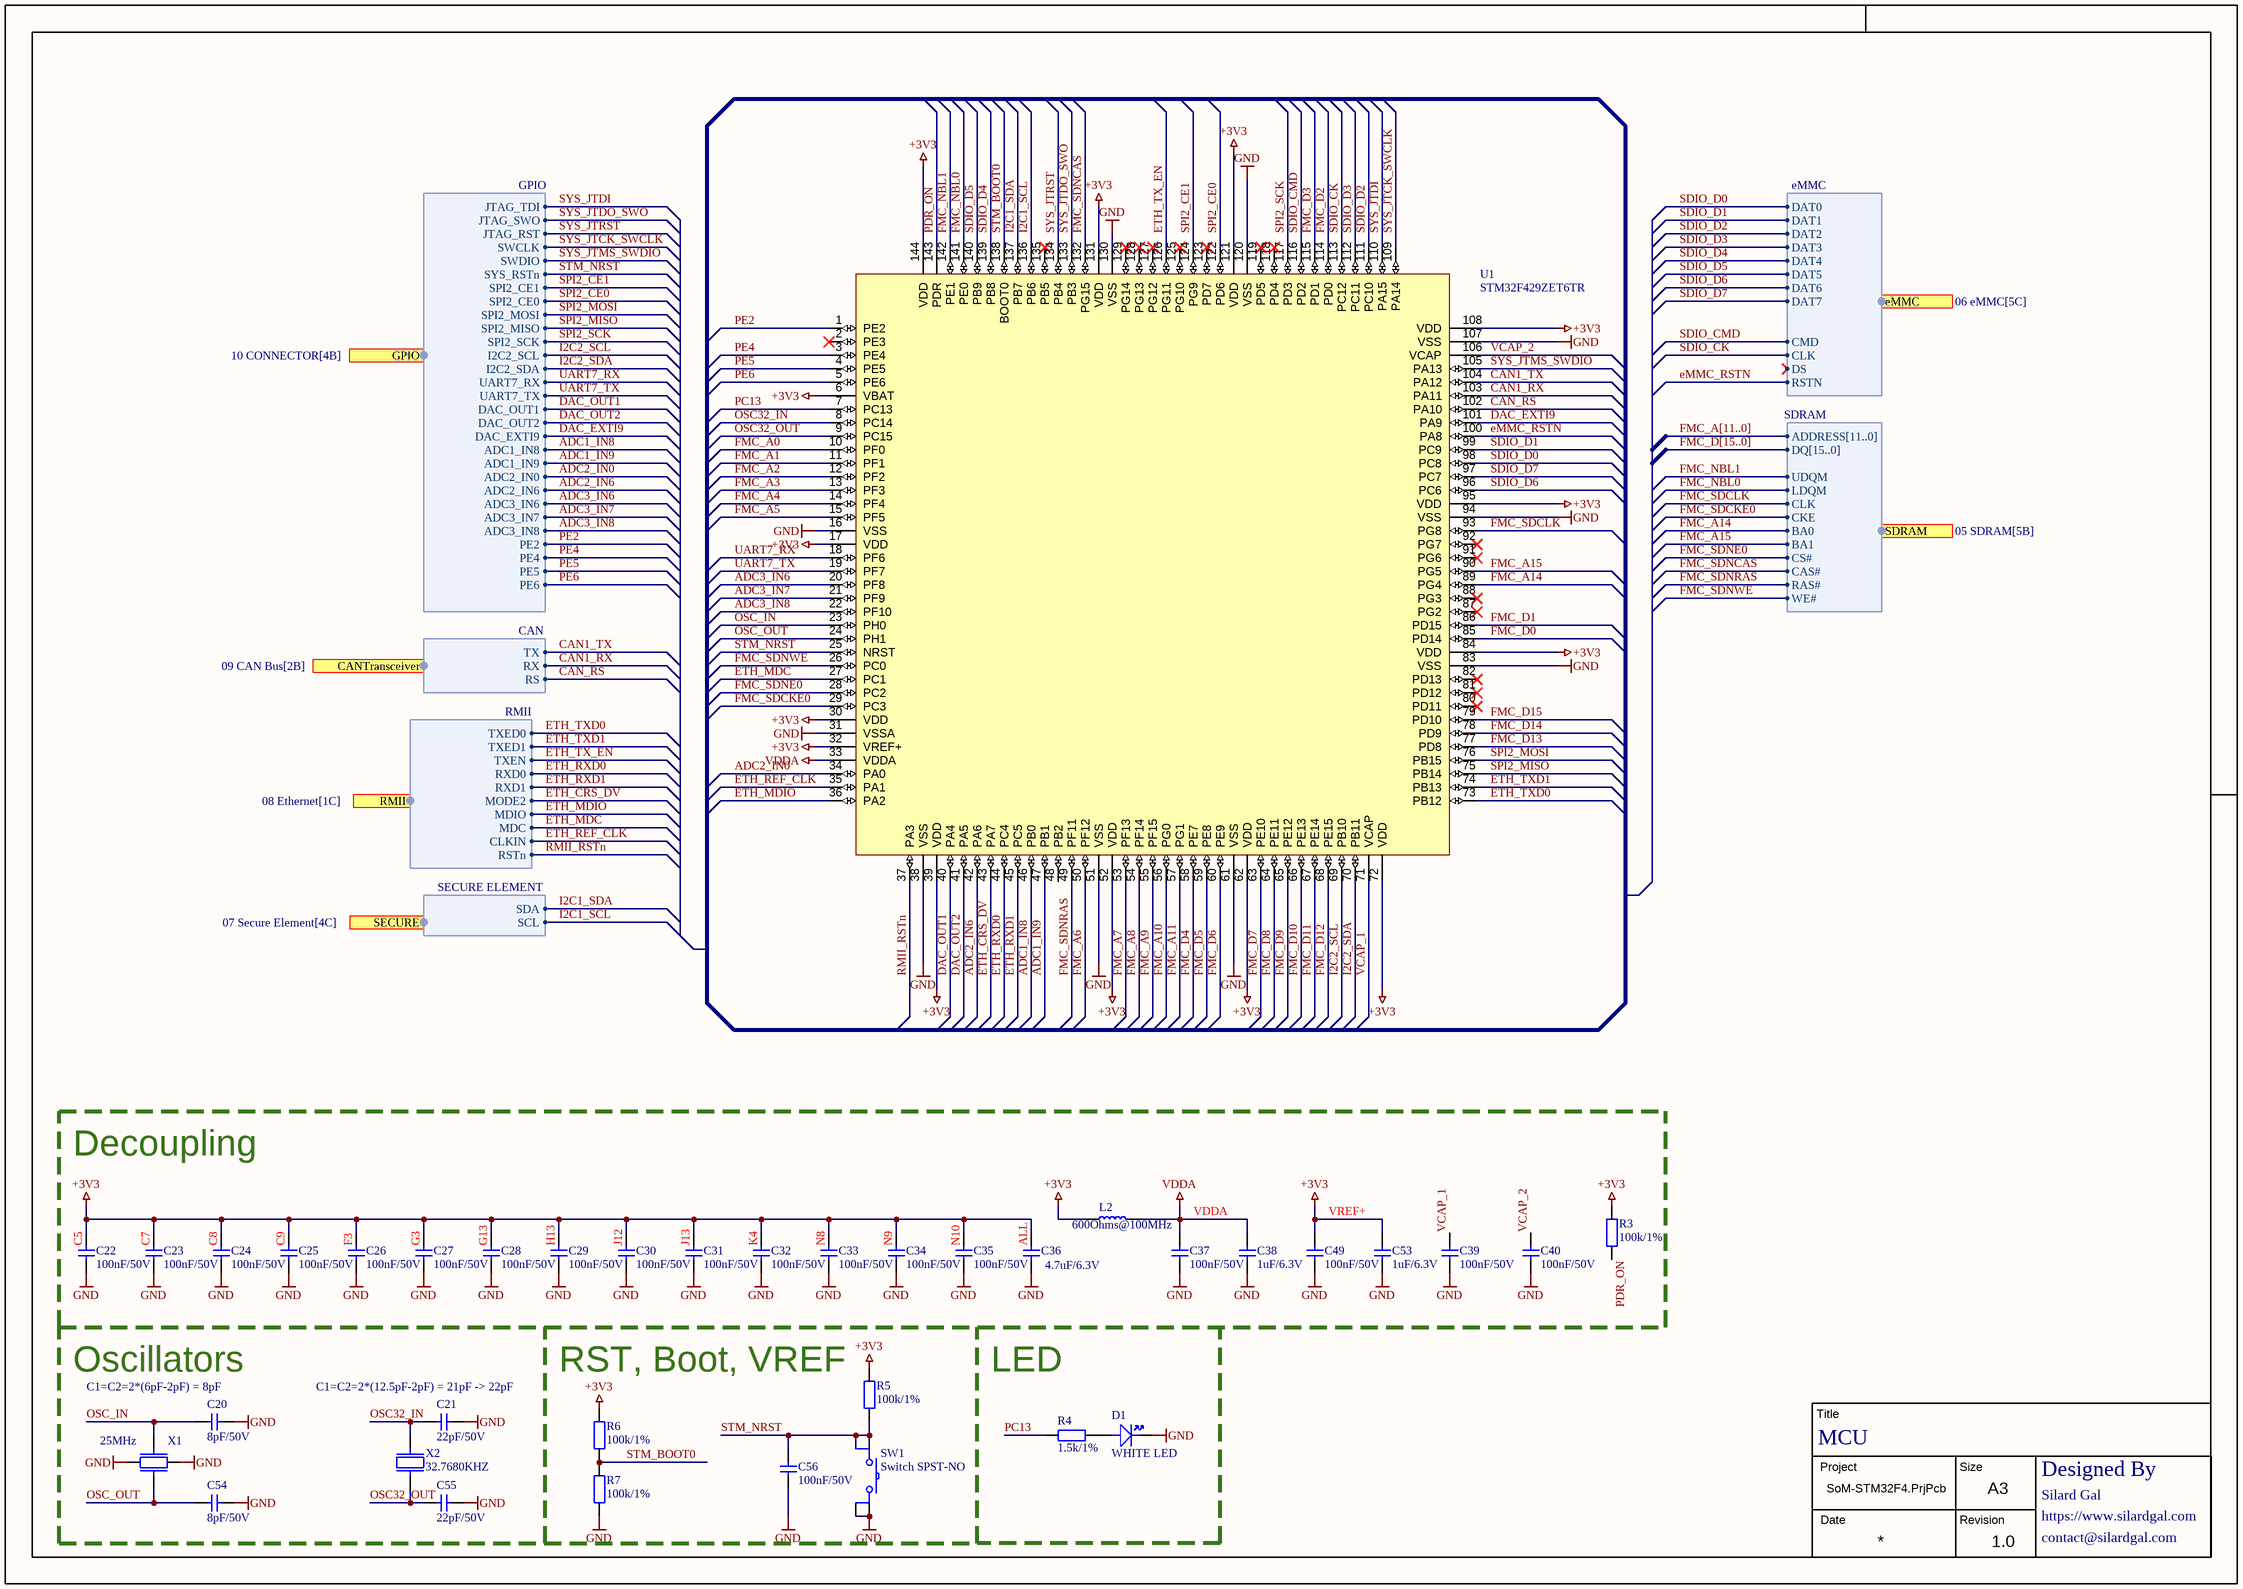
[diagram p7: 04 MCU.SchDoc]

### Parts
C20  8pF/50V  [CAPC1005X06M-0402]
C21  22pF/50V  [CAPC1005X06M-0402]
C22  100nF/50V  [CAPC1005X06M-0402]
C23  100nF/50V  [CAPC1005X06M-0402]
C24  100nF/50V  [CAPC1005X06M-0402]
C25  100nF/50V  [CAPC1005X06M-0402]
C26  100nF/50V  [CAPC1005X06M-0402]
C27  100nF/50V  [CAPC1005X06M-0402]
C28  100nF/50V  [CAPC1005X06M-0402]
C29  100nF/50V  [CAPC1005X06M-0402]
C30  100nF/50V  [CAPC1005X06M-0402]
C31  100nF/50V  [CAPC1005X06M-0402]
C32  100nF/50V  [CAPC1005X06M-0402]
C33  100nF/50V  [CAPC1005X06M-0402]
C34  100nF/50V  [CAPC1005X06M-0402]
C35  100nF/50V  [CAPC1005X06M-0402]
C36  4.7uF/6.3V  [CAPC1005X06M-0402]
C37  100nF/50V  [CAPC1005X06M-0402]
C38  1uF/6.3V  [CAPC1005X06M-0402]
C39  100nF/50V  [CAPC1005X06M-0402]
C40  100nF/50V  [CAPC1005X06M-0402]
C49  100nF/50V  [CAPC1005X06M-0402]
C53  1uF/6.3V  [CAPC1005X06M-0402]
C54  8pF/50V  [CAPC1005X06M-0402]
C55  22pF/50V  [CAPC1005X06M-0402]
C56  100nF/50V  [CAPC1005X06M-0402]
D1  WHITE LED  [LED-0402]
L2  600Ohms@100MHz  [INDC1005X06M-0402]
R3  100k/1%  [RESC1005X04M-0402]
R4  1.5k/1%  [RESC1005X04M-0402]
R5  100k/1%  [RESC1005X04M-0402]
R6  100k/1%  [RESC1005X04M-0402]
R7  100k/1%  [RESC1005X04M-0402]
SW1  Switch SPST-NO  [PTS815 SJM 250 SMTR LFS]
U1  STM32F429ZET6TR  [TSQFP50P2200X2200X160-144N]
X1  25MHz  [4-SMD]
X2  32.7680KHZ  [2-SMD]

### Ports
CANTransceiver (harness CAN, see 09 CAN Bus[2B]), eMMC (harness eMMC, see 06 eMMC[5C]), GPIO (harness GPIO, see 10 CONNECTOR[4B]), RMII (harness RMII, see 08 Ethernet[1C]), SDRAM (harness SDRAM, see 05 SDRAM[5B]), SECURE (harness SECURE ELEMENT, see 07 Secure Element[4C])

### Harnesses
SDRAM: ADDRESS[11..0], DQ[15..0], UDQM, LDQM, CLK, CKE, BA0, BA1, CS#, CAS#, RAS#, WE#
SECURE ELEMENT: SDA, SCL
RMII: TXED0, TXED1, TXEN, RXD0, RXD1, MODE2, MDIO, MDC, CLKIN, RSTn
GPIO: JTAG_TDI, JTAG_SWO, JTAG_RST, SWCLK, SWDIO, SYS_RSTn, SPI2_CE1, SPI2_CE0, SPI2_MOSI, SPI2_MISO, SPI2_SCK, I2C2_SCL, I2C2_SDA, UART7_RX, UART7_TX, DAC_OUT1, DAC_OUT2, DAC_EXTI9, ADC1_IN8, ADC1_IN9, ADC2_IN0, ADC2_IN6, ADC3_IN6, ADC3_IN7, ADC3_IN8, PE2, PE4, PE5, PE6
CAN: TX, RX, RS
eMMC: DAT0, DAT1, DAT2, DAT3, DAT4, DAT5, DAT6, DAT7, CMD, CLK, DS, RSTN

### Nets
+3V3: C22.2 C23.2 C24.2 C25.2 C26.2 C27.2 C28.2 C29.2 C30.2 C31.2 C32.2 C33.2 C34.2 C35.2 C36.2 C49.2 C53.2 L2.1 R3.1 R5.1 R6.1 U1.6(VBAT) U1.17(VDD) U1.30(VDD) U1.32(VREF+) U1.39(VDD) U1.52(VDD) U1.62(VDD) U1.72(VDD) U1.84(VDD) U1.95(VDD) U1.108(VDD) U1.121(VDD) U1.131(VDD) U1.144(VDD)
GND: C20.2 C21.2 C22.1 C23.1 C24.1 C25.1 C26.1 C27.1 C28.1 C29.1 C30.1 C31.1 C32.1 C33.1 C34.1 C35.1 C36.1 C37.1 C38.1 C39.1 C40.1 C49.1 C53.1 C54.2 C55.2 C56.1 D1.1 R7.1 SW1.3 SW1.4 U1.16(VSS) U1.31(VSSA) U1.38(VSS) U1.51(VSS) U1.61(VSS) U1.83(VSS) U1.94(VSS) U1.107(VSS) U1.120(VSS) U1.130(VSS) X1.2 X1.4
VDDA: C37.2 C38.2 L2.2 U1.33(VDDA)
ADC1_IN8: U1.46(PB0) ; port GPIO.ADC1_IN8
ADC1_IN9: U1.47(PB1) ; port GPIO.ADC1_IN9
ADC2_IN0: U1.34(PA0) ; port GPIO.ADC2_IN0
ADC2_IN6: U1.42(PA6) ; port GPIO.ADC2_IN6
ADC3_IN6: U1.20(PF8) ; port GPIO.ADC3_IN6
ADC3_IN7: U1.21(PF9) ; port GPIO.ADC3_IN7
ADC3_IN8: U1.22(PF10) ; port GPIO.ADC3_IN8
CAN1_RX: U1.103(PA11) ; port CANTransceiver.RX
CAN1_TX: U1.104(PA12) ; port CANTransceiver.TX
CAN_RS: U1.102(PA10) ; port CANTransceiver.RS
DAC_EXTI9: U1.101(PA9) ; port GPIO.DAC_EXTI9
DAC_OUT1: U1.40(PA4) ; port GPIO.DAC_OUT1
DAC_OUT2: U1.41(PA5) ; port GPIO.DAC_OUT2
eMMC_RSTN: U1.100(PA8) ; port eMMC.RSTN
ETH_CRS_DV: U1.43(PA7) ; port RMII.MODE2
ETH_MDC: U1.27(PC1) ; port RMII.MDC
ETH_MDIO: U1.36(PA2) ; port RMII.MDIO
ETH_REF_CLK: U1.35(PA1) ; port RMII.CLKIN
ETH_RXD0: U1.44(PC4) ; port RMII.RXD0
ETH_RXD1: U1.45(PC5) ; port RMII.RXD1
ETH_TX_EN: U1.126(PG11) ; port RMII.TXEN
ETH_TXD0: U1.73(PB12) ; port RMII.TXED0
ETH_TXD1: U1.74(PB13) ; port RMII.TXED1
FMC_A0: U1.10(PF0)
FMC_A1: U1.11(PF1)
FMC_A2: U1.12(PF2)
FMC_A3: U1.13(PF3)
FMC_A4: U1.14(PF4)
FMC_A5: U1.15(PF5)
FMC_A6: U1.50(PF12)
FMC_A7: U1.53(PF13)
FMC_A8: U1.54(PF14)
FMC_A9: U1.55(PF15)
FMC_A10: U1.56(PG0)
FMC_A11: U1.57(PG1)
FMC_A14: U1.89(PG4) ; port SDRAM.BA0
FMC_A15: U1.90(PG5) ; port SDRAM.BA1
FMC_D0: U1.85(PD14)
FMC_D1: U1.86(PD15)
FMC_D2: U1.114(PD0)
FMC_D3: U1.115(PD1)
FMC_D4: U1.58(PE7)
FMC_D5: U1.59(PE8)
FMC_D6: U1.60(PE9)
FMC_D7: U1.63(PE10)
FMC_D8: U1.64(PE11)
FMC_D9: U1.65(PE12)
FMC_D10: U1.66(PE13)
FMC_D11: U1.67(PE14)
FMC_D12: U1.68(PE15)
FMC_D13: U1.77(PD8)
FMC_D14: U1.78(PD9)
FMC_D15: U1.79(PD10)
FMC_NBL0: U1.141(PE0) ; port SDRAM.LDQM
FMC_NBL1: U1.142(PE1) ; port SDRAM.UDQM
FMC_SDCKE0: U1.29(PC3) ; port SDRAM.CKE
FMC_SDCLK: U1.93(PG8) ; port SDRAM.CLK
FMC_SDNCAS: U1.132(PG15) ; port SDRAM.CAS#
FMC_SDNE0: U1.28(PC2) ; port SDRAM.CS#
FMC_SDNRAS: U1.49(PF11) ; port SDRAM.RAS#
FMC_SDNWE: U1.26(PC0) ; port SDRAM.WE#
I2C1_SCL: U1.136(PB6) ; port SECURE.SCL
I2C1_SDA: U1.137(PB7) ; port SECURE.SDA
I2C2_SCL: U1.69(PB10) ; port GPIO.I2C2_SCL
I2C2_SDA: U1.70(PB11) ; port GPIO.I2C2_SDA
OSC32_IN: C21.1 U1.8(PC14) X2.2
OSC32_OUT: C55.1 U1.9(PC15) X2.1
OSC_IN: C20.1 U1.23(PH0) X1.3
OSC_OUT: C54.1 U1.24(PH1) X1.1
PC13: R4.1 U1.7(PC13)
PDR_ON: R3.2 U1.143(PDR)
PE2: U1.1(PE2) ; port GPIO.PE2
PE4: U1.3(PE4) ; port GPIO.PE4
PE5: U1.4(PE5) ; port GPIO.PE5
PE6: U1.5(PE6) ; port GPIO.PE6
RMII_RSTn: U1.37(PA3) ; port RMII.RSTn
SDIO_CK: U1.113(PC12) ; port eMMC.CLK  [project net eMMC_CLK]
SDIO_CMD: U1.116(PD2) ; port eMMC.CMD  [project net eMMC_CMD]
SDIO_D0: U1.98(PC8) ; port eMMC.DAT0  [project net eMMC_DAT0]
SDIO_D1: U1.99(PC9) ; port eMMC.DAT1  [project net eMMC_DAT1]
SDIO_D2: U1.111(PC10) ; port eMMC.DAT2  [project net eMMC_DAT2]
SDIO_D3: U1.112(PC11) ; port eMMC.DAT3  [project net eMMC_DAT3]
SDIO_D4: U1.139(PB8) ; port eMMC.DAT4  [project net eMMC_DAT4]
SDIO_D5: U1.140(PB9) ; port eMMC.DAT5  [project net eMMC_DAT5]
SDIO_D6: U1.96(PC6) ; port eMMC.DAT6  [project net eMMC_DAT6]
SDIO_D7: U1.97(PC7) ; port eMMC.DAT7  [project net eMMC_DAT7]
SPI2_CE0: U1.122(PD6) ; port GPIO.SPI2_CE0
SPI2_CE1: U1.124(PG9) ; port GPIO.SPI2_CE1
SPI2_MISO: U1.75(PB14) ; port GPIO.SPI2_MISO
SPI2_MOSI: U1.76(PB15) ; port GPIO.SPI2_MOSI
SPI2_SCK: U1.117(PD3) ; port GPIO.SPI2_SCK
STM_BOOT0: R6.2 R7.2 U1.138(BOOT0)
STM_NRST: C56.2 R5.2 SW1.1 SW1.2 U1.25(NRST) ; port GPIO.SYS_RSTn
SYS_JTCK_SWCLK: U1.109(PA14) ; port GPIO.SWCLK
SYS_JTDI: U1.110(PA15) ; port GPIO.JTAG_TDI
SYS_JTDO_SWO: U1.133(PB3) ; port GPIO.JTAG_SWO
SYS_JTMS_SWDIO: U1.105(PA13) ; port GPIO.SWDIO
SYS_JTRST: U1.134(PB4) ; port GPIO.JTAG_RST
UART7_RX: U1.18(PF6) ; port GPIO.UART7_RX
UART7_TX: U1.19(PF7) ; port GPIO.UART7_TX
VCAP_1: C39.2 U1.71(VCAP)
VCAP_2: C40.2 U1.106(VCAP)
NetD1_2: D1.2 R4.2

Not connected (* = marked no-connect by the designer): U1 2(PE3)* 48(PB2) 80(PD11)* 81(PD12)* 82(PD13)* 87(PG2)* 88(PG3)* 91(PG6)* 92(PG7)* 118(PD4)* 119(PD5)* 123(PD7)* 125(PG10)* 127(PG12)* 128(PG13)* 129(PG14)* 135(PB5)*

### Buses and harness runs
bus FMC_A[11..0]
bus FMC_D[15..0]

### Notes on the sheet
- Decoupling
- (near C22) C5
- (near C23) C7
- (near C24) C8
- (near C25) C9
- (near C26) F3
- (near C27) G3
- (near C28) G13
- (near C29) H13
- (near C30) J12
- (near C31) J13
- (near C32) K4
- (near C33) N8
- (near C34) N9
- (near C35) N10
- (near C36) ALL
- VDDA
- VREF+
- (near C20) Oscillators
- (near C20) C1=C2=2*(6pF-2pF) = 8pF
- (near C21) C1=C2=2*(12.5pF-2pF) = 21pF -> 22pF
- RST, Boot, VREF
- LED
- Title
- Project
- Size
- Date
- Revision
- A3
- Designed By

### Library data of the parts
C20 C54 = GRM1555C1H8R0BA01D: 8 pF ±0.1pF 50V Ceramic Capacitor C0G, NP0 0402 (1005 Metric); ComponentLink1Description: Datasheet; ComponentLink1URL: https://search.murata.co.jp/Ceramy/image/img/A01X/G101/ENG/GRM155R60J475ME47-01.pdf; MPN: GRM1555C1H8R0BA01D
C21 C55 = GRM1555C1H220JA01D: 22 pF ±5% 50V Ceramic Capacitor C0G, NP0 0402 (1005 Metric); ComponentLink1Description: Datasheet; ComponentLink1URL: https://search.murata.co.jp/Ceramy/image/img/A01X/G101/ENG/GRM155R60J475ME47-01.pdf; MPN: GRM1555C1H220JA01D
C22-C35 C37 C39 C40 C49 C56 = GRM155R71H104KE14D: as C5 on sheet 05 SDRAM; ComponentLink1Description: Datasheet; ComponentLink1URL: https://search.murata.co.jp/Ceramy/image/img/A01X/G101/ENG/GRM155R60J475ME47-01.pdf; MPN: GRM155R71H104KE14D
C36 = GRM155R60J475ME47D: as C12 on sheet 06 eMMC; ComponentLink1Description: Datasheet; ComponentLink1URL: https://search.murata.co.jp/Ceramy/image/img/A01X/G101/ENG/GRM155R60J475ME47-01.pdf; MPN: GRM155R60J475ME47D
C38 C53 = GRM155R70J105KA12J: as C44 on sheet 08 Ethernet; ComponentLink1Description: Datasheet; ComponentLink1URL: https://search.murata.co.jp/Ceramy/image/img/A01X/G101/ENG/GRM155R60J475ME47-01.pdf; MPN: GRM155R70J105KA12J
D1 = QBLP595-IW-2897: White LED Indication - Discrete 3.1V 0402 (1005 Metric); ComponentLink1Description: Datasheet; ComponentLink1URL: https://www.qt-brightek.com/datasheet/QBLP595-IW-2897.pdf; MPN: QBLP595-IW-2897
L2 = BLM15AG601SN1D: as L3 on sheet 08 Ethernet; ComponentLink1Description: Datasheet; ComponentLink1URL: https://www.murata.com/en-us/products/productdata/8796740059166/ENFA0018.pdf; MPN: BLM15AG601SN1D
R3 R5-R7 = RC0402FR-07100KL: as R20 on sheet 08 Ethernet; ComponentLink1Description: Datasheet; ComponentLink1URL: https://www.yageo.com/upload/media/product/productsearch/datasheet/rchip/PYu-RC_Group_51_RoHS_L_12.pdf; MPN: RC0402FR-07100KL
R4 = RC0402FR-071K5L: as R15 on sheet 08 Ethernet; ComponentLink1Description: Datasheet; ComponentLink1URL: https://www.yageo.com/upload/media/product/productsearch/datasheet/rchip/PYu-RC_Group_51_RoHS_L_12.pdf; MPN: RC0402FR-071K5L
SW1 = PTS815 SJM 250 SMTR LFS: Tactile Switch SPST-NO Top Actuated Surface Mount; ComponentLink1Description: Datasheet; ComponentLink1URL: https://www.ckswitches.com/media/2728/pts815.pdf; MPN: PTS815 SJM 250 SMTR LFS
U1 = STM32F429ZET6TR: ARM® Cortex®-M4 STM32F4 Microcontroller IC 32-Bit Single-Core 180MHz 512KB (512K x 8) FLASH 144-LQFP (20x20); MPN: STM32F429ZET6TR; ComponentLink1Description: New link; ComponentLink1URL: https://www.st.com/content/ccc/resource/technical/document/datasheet/03/b4/b2/36/4c/72/49/29/DM00071990.pdf/files/DM00071990.pdf/jcr:content/translations/en.DM00071990.pdf
X1 = XRCGB25M000F3M00R0: 25 MHz ±30ppm Crystal 6pF 150 Ohms 4-SMD, No Lead; ComponentLink1Description: Datasheet; ComponentLink1URL: https://www.murata.com/~/media/webrenewal/campaign/ads/america/timing/p79e.ashx?la=en-us; MPN: XRCGB25M000F3M00R0
X2 = ECS-.327-12.5-16-TR: 32.768 kHz ±20ppm Crystal 12.5pF 90 kOhms 2-SMD, No Lead; ComponentLink1Description: Datasheet; ComponentLink1URL: https://ecsxtal.com/store/pdf/ECX-16.pdf; MPN: ECS-.327-12.5-16-TR

## Sheet 10 CONNECTOR.SchDoc: Connector
size 420 x 297 mm; SheetNumber: 9; SheetTotal: 10
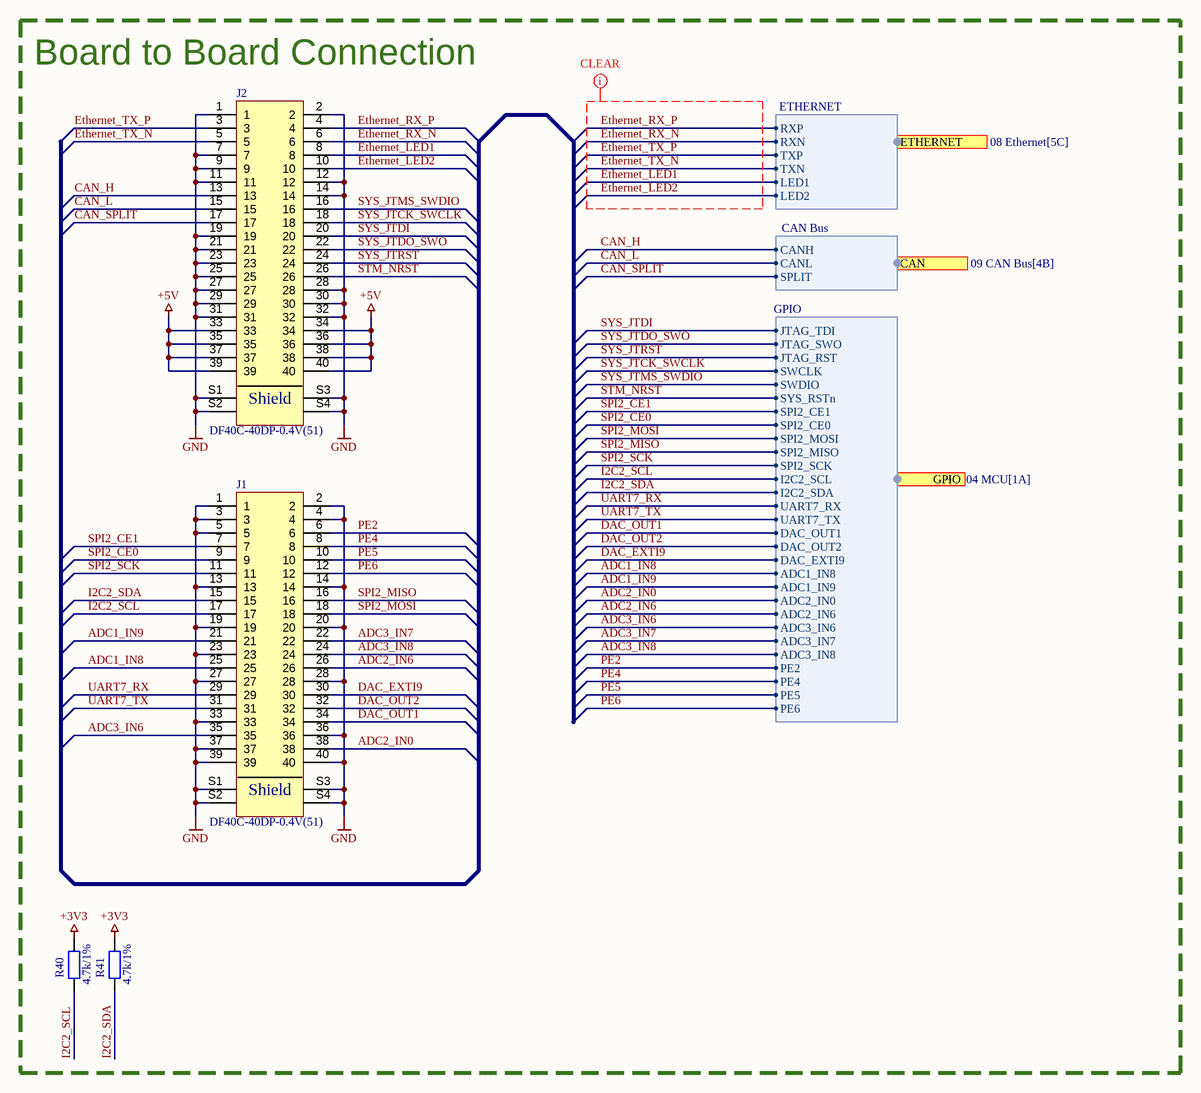
[diagram p8: 10 CONNECTOR.SchDoc]

### Parts
J1  DF40C-40DP-0.4V(51)  [DF40C-40DP-0.4V(51)]
J2  DF40C-40DP-0.4V(51)  [DF40C-40DP-0.4V(51)]
R40  4.7k/1%  [RESC1005X04M-0402]
R41  4.7k/1%  [RESC1005X04M-0402]

### Blocks framed on the sheet
Board to Board Connection: J1 J2 R40 R41

### Ports
CAN (harness CAN Bus, see 09 CAN Bus[4B]), ETHERNET (harness ETHERNET, see 08 Ethernet[5C]), GPIO (harness GPIO, see 04 MCU[1A])

### Harnesses
CAN Bus: CANH, CANL, SPLIT
ETHERNET: RXP, RXN, TXP, TXN, LED1, LED2
GPIO: JTAG_TDI, JTAG_SWO, JTAG_RST, SWCLK, SWDIO, SYS_RSTn, SPI2_CE1, SPI2_CE0, SPI2_MOSI, SPI2_MISO, SPI2_SCK, I2C2_SCL, I2C2_SDA, UART7_RX, UART7_TX, DAC_OUT1, DAC_OUT2, DAC_EXTI9, ADC1_IN8, ADC1_IN9, ADC2_IN0, ADC2_IN6, ADC3_IN6, ADC3_IN7, ADC3_IN8, PE2, PE4, PE5, PE6

### Nets
+3V3: R40.2 R41.2
+5V: J2.33 J2.34 J2.35 J2.36 J2.37 J2.38 J2.39 J2.40
GND: J1.1 J1.2 J1.3 J1.4 J1.5 J1.13 J1.14 J1.19 J1.20 J1.23 J1.27 J1.28 J1.33 J1.36 J1.37 J1.39 J1.40 J1.S1 J1.S2 J1.S3 J1.S4 J2.1 J2.2 J2.7 J2.9 J2.11 J2.12 J2.14 J2.19 J2.21 J2.23 J2.25 J2.27 J2.28 J2.29 J2.30 J2.31 J2.32 J2.S1 J2.S2 J2.S3 J2.S4
ADC1_IN8: J1.25 ; port GPIO.ADC1_IN8
ADC1_IN9: J1.21 ; port GPIO.ADC1_IN9
ADC2_IN0: J1.38 ; port GPIO.ADC2_IN0
ADC2_IN6: J1.26 ; port GPIO.ADC2_IN6
ADC3_IN6: J1.35 ; port GPIO.ADC3_IN6
ADC3_IN7: J1.22 ; port GPIO.ADC3_IN7
ADC3_IN8: J1.24 ; port GPIO.ADC3_IN8
CAN_H: J2.13 ; port CAN.CANH
CAN_L: J2.15 ; port CAN.CANL
CAN_SPLIT: J2.17 ; port CAN.SPLIT
DAC_EXTI9: J1.30 ; port GPIO.DAC_EXTI9
DAC_OUT1: J1.34 ; port GPIO.DAC_OUT1
DAC_OUT2: J1.32 ; port GPIO.DAC_OUT2
Ethernet_LED1: J2.8 ; port ETHERNET.LED1
Ethernet_LED2: J2.10 ; port ETHERNET.LED2
Ethernet_RX_N: J2.6 ; port ETHERNET.RXN
Ethernet_RX_P: J2.4 ; port ETHERNET.RXP
Ethernet_TX_N: J2.5 ; port ETHERNET.TXN
Ethernet_TX_P: J2.3 ; port ETHERNET.TXP
I2C2_SCL: J1.17 R40.1 ; port GPIO.I2C2_SCL
I2C2_SDA: J1.15 R41.1 ; port GPIO.I2C2_SDA
PE2: J1.6 ; port GPIO.PE2
PE4: J1.8 ; port GPIO.PE4
PE5: J1.10 ; port GPIO.PE5
PE6: J1.12 ; port GPIO.PE6
SPI2_CE0: J1.9 ; port GPIO.SPI2_CE0
SPI2_CE1: J1.7 ; port GPIO.SPI2_CE1
SPI2_MISO: J1.16 ; port GPIO.SPI2_MISO
SPI2_MOSI: J1.18 ; port GPIO.SPI2_MOSI
SPI2_SCK: J1.11 ; port GPIO.SPI2_SCK
STM_NRST: J2.26 ; port GPIO.SYS_RSTn
SYS_JTCK_SWCLK: J2.18 ; port GPIO.SWCLK
SYS_JTDI: J2.20 ; port GPIO.JTAG_TDI
SYS_JTDO_SWO: J2.22 ; port GPIO.JTAG_SWO
SYS_JTMS_SWDIO: J2.16 ; port GPIO.SWDIO
SYS_JTRST: J2.24 ; port GPIO.JTAG_RST
UART7_RX: J1.29 ; port GPIO.UART7_RX
UART7_TX: J1.31 ; port GPIO.UART7_TX

### Layout directives
net class CLEAR: Ethernet_LED1, Ethernet_LED2, Ethernet_RX_N, Ethernet_RX_P, Ethernet_TX_N, Ethernet_TX_P

### Notes on the sheet
- Title
- Project
- Size
- Date
- Revision
- A3
- Designed By
- (in symbol DF40C-40DP-0.4V(51)) Shield

### Library data of the parts
J1 J2 = DF40C-40DP-0.4V(51): 40 Position Connector Plug, Outer Shroud Contacts Surface Mount Gold; MPN: DF40C-40DP-0.4V(51); ComponentLink1Description: Datasheet; ComponentLink1URL: https://www.hirose.com/en/product/document?clcode=&productname=&series=DF40&documenttype=Catalog&lang=en&documentid=en_DF40_CAT
R40 R41 = RC0402FR-074K7L: as R38 on sheet 07 Secure Element; ComponentLink1Description: Datasheet; ComponentLink1URL: https://www.yageo.com/upload/media/product/productsearch/datasheet/rchip/PYu-RC_Group_51_RoHS_L_12.pdf; MPN: RC0402FR-074K7L

## Sheet 03 POWER.SchDoc: POWER
size 420 x 297 mm; SheetNumber: 3; SheetTotal: 10
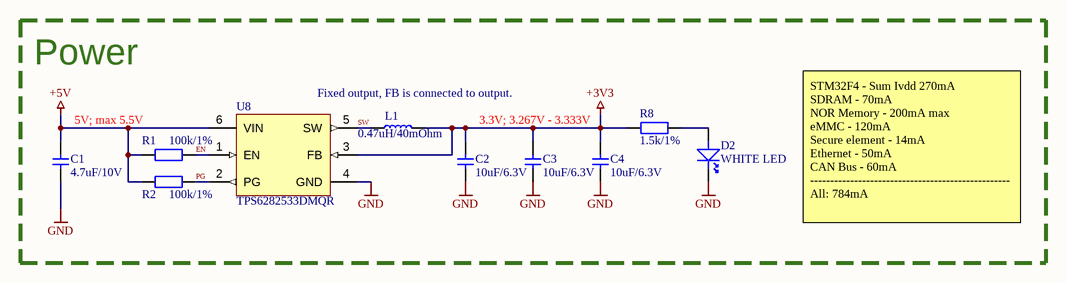
[diagram p9: 03 POWER.SchDoc]

### Parts
C1  4.7uF/10V  [CAPC1608X10M-0603]
C2  10uF/6.3V  [CAPC1005X06M-0402]
C3  10uF/6.3V  [CAPC1005X06M-0402]
C4  10uF/6.3V  [CAPC1005X06M-0402]
D2  WHITE LED  [LED-0402]
L1  0.47uH/40mOhm  [INDC200x160-2016]
R1  100k/1%  [RESC1005X04M-0402]
R2  100k/1%  [RESC1005X04M-0402]
R8  1.5k/1%  [RESC1005X04M-0402]
U8  TPS6282533DMQR  [VSON-HR (DMQ)]

### Nets
+3V3: C2.2 C3.2 C4.2 L1.2 R8.1 U8.3(FB)
+5V: C1.2 R1.2 R2.2 U8.6(VIN)
GND: C1.1 C2.1 C3.1 C4.1 D2.1 U8.4(GND)
EN: R1.1 U8.1(EN)
PG: R2.1 U8.2(PG)
SW: L1.1 U8.5(SW)
NetD2_2: D2.2 R8.2

### Notes on the sheet
- Power
- 5V; max 5.5V
- Fixed output, FB is connected to output.
- 3.3V; 3.267V - 3.333V
- STM32F4 - Sum Ivdd 270mA
  SDRAM - 70mA
  NOR Memory - 200mA max
  eMMC - 120mA
  Secure element - 14mA
  Ethernet - 50mA
  CAN Bus - 60mA
  --------------------------------------------------
  All: 784mA
- Title
- Project
- Size
- Date
- Revision
- A3
- Designed By

### Library data of the parts
C1 = GRM188C71A475KE11D: 4.7 µF ±10% 10V Ceramic Capacitor X7S 0603 (1608 Metric); ComponentLink1Description: Datasheet; ComponentLink1URL: https://search.murata.co.jp/Ceramy/image/img/A01X/G101/ENG/GRM188R60J476ME15-01.pdf; MPN: GRM188C71A475KE11D
C2-C4 = GRM155R60J106ME05J: 10 µF ±20% 6.3V Ceramic Capacitor X5R 0402 (1005 Metric); ComponentLink1Description: Datasheet; ComponentLink1URL: https://search.murata.co.jp/Ceramy/image/img/A01X/G101/ENG/GRM155R60J106ME05-01A.pdf; MPN: GRM155R60J106ME05J
D2 = QBLP595-IW-2897: as D1 on sheet 04 MCU; ComponentLink1Description: Datasheet; ComponentLink1URL: https://www.qt-brightek.com/datasheet/QBLP595-IW-2897.pdf; MPN: QBLP595-IW-2897
L1 = SRP2010DPA-R47M: 470 nH Shielded Inductor 3.6 A 40mOhm Max 0806 (2016 Metric); ComponentLink1Description: Datasheet; ComponentLink1URL: https://media.digikey.com/pdf/Data%20Sheets/Bourns%20PDFs/SRP2010DPA_Series_DS.pdf; MPN: SRP2010DPA-R47M
R1 R2 = RC0402FR-07100KL: as R20 on sheet 08 Ethernet; ComponentLink1Description: Datasheet; ComponentLink1URL: https://www.yageo.com/upload/media/product/productsearch/datasheet/rchip/PYu-RC_Group_51_RoHS_L_12.pdf; MPN: RC0402FR-07100KL
R8 = RC0402FR-071K5L: as R15 on sheet 08 Ethernet; ComponentLink1Description: Datasheet; ComponentLink1URL: https://www.yageo.com/upload/media/product/productsearch/datasheet/rchip/PYu-RC_Group_51_RoHS_L_12.pdf; MPN: RC0402FR-071K5L
U8 = TPS6282533DMQR: Buck Switching Regulator IC Positive Fixed 3.3V 1 Output 2A 6-VFDFN; ComponentLink1Description: Datasheet; ComponentLink1URL: https://www.ti.com/lit/ds/symlink/tps62825.pdf; MPN: TPS6282533DMQR

## Nets that join several sheets
+3V3: 05 SDRAM (14 pins), 06 eMMC (33 pins), 07 Secure Element (C19.2 R38.2 R39.2 U5.8), 09 CAN Bus (C51.2 C52.2 U7.3), 08 Ethernet (5 pins), 04 MCU (35 pins), 10 CONNECTOR (R40.2 R41.2), 03 POWER (6 pins)
+5V: 10 CONNECTOR (8 pins), 03 POWER (C1.2 R1.2 R2.2 U8.6)
GND: 05 SDRAM (14 pins), 06 eMMC (23 pins), 07 Secure Element (C19.1 U5.4 U5.9), 09 CAN Bus (C51.1 C52.1 U7.2 U7.9), 08 Ethernet (11 pins), 04 MCU (42 pins), 10 CONNECTOR (42 pins), 03 POWER (6 pins)
ADC1_IN8: 04 MCU (U1.46), 10 CONNECTOR (J1.25)
ADC1_IN9: 04 MCU (U1.47), 10 CONNECTOR (J1.21)
ADC2_IN0: 04 MCU (U1.34), 10 CONNECTOR (J1.38)
ADC2_IN6: 04 MCU (U1.42), 10 CONNECTOR (J1.26)
ADC3_IN6: 04 MCU (U1.20), 10 CONNECTOR (J1.35)
ADC3_IN7: 04 MCU (U1.21), 10 CONNECTOR (J1.22)
ADC3_IN8: 04 MCU (U1.22), 10 CONNECTOR (J1.24)
CAN1_RX: 09 CAN Bus (U7.4), 04 MCU (U1.103)
CAN1_TX: 09 CAN Bus (U7.1), 04 MCU (U1.104)
CAN_H: 09 CAN Bus (U7.7), 10 CONNECTOR (J2.13)
CAN_L: 09 CAN Bus (U7.6), 10 CONNECTOR (J2.15)
CAN_RS: 09 CAN Bus (U7.8), 04 MCU (U1.102)
CAN_SPLIT: 09 CAN Bus (U7.5), 10 CONNECTOR (J2.17)
DAC_EXTI9: 04 MCU (U1.101), 10 CONNECTOR (J1.30)
DAC_OUT1: 04 MCU (U1.40), 10 CONNECTOR (J1.34)
DAC_OUT2: 04 MCU (U1.41), 10 CONNECTOR (J1.32)
eMMC_CLK: 06 eMMC (R37.1), 04 MCU (U1.113)
eMMC_CMD: 06 eMMC (R10.1 U3.P5), 04 MCU (U1.116)
eMMC_DAT0: 06 eMMC (R27.1 U3.K2), 04 MCU (U1.98)
eMMC_DAT1: 06 eMMC (R26.1 U3.N2), 04 MCU (U1.99)
eMMC_DAT2: 06 eMMC (R25.1 U3.K3), 04 MCU (U1.111)
eMMC_DAT3: 06 eMMC (R24.1 U3.N3), 04 MCU (U1.112)
eMMC_DAT4: 06 eMMC (R14.1 U3.N8), 04 MCU (U1.139)
eMMC_DAT5: 06 eMMC (R13.1 U3.K8), 04 MCU (U1.140)
eMMC_DAT6: 06 eMMC (R12.1 U3.N9), 04 MCU (U1.96)
eMMC_DAT7: 06 eMMC (R11.1 U3.K9), 04 MCU (U1.97)
eMMC_RSTN: 06 eMMC (R9.1 U3.M5), 04 MCU (U1.100)
ETH_CRS_DV: 08 Ethernet (R19.1), 04 MCU (U1.43)
ETH_MDC: 08 Ethernet (U6.13), 04 MCU (U1.27)
ETH_MDIO: 08 Ethernet (R15.1 U6.12), 04 MCU (U1.36)
ETH_REF_CLK: 08 Ethernet (R22.1), 04 MCU (U1.35)
ETH_RXD0: 08 Ethernet (R17.1), 04 MCU (U1.44)
ETH_RXD1: 08 Ethernet (R18.1), 04 MCU (U1.45)
ETH_TX_EN: 08 Ethernet (U6.16), 04 MCU (U1.126)
ETH_TXD0: 08 Ethernet (U6.17), 04 MCU (U1.73)
ETH_TXD1: 08 Ethernet (U6.18), 04 MCU (U1.74)
Ethernet_LED1: 08 Ethernet (U6.3), 10 CONNECTOR (J2.8)
Ethernet_LED2: 08 Ethernet (U6.2), 10 CONNECTOR (J2.10)
Ethernet_RX_N: 08 Ethernet (U6.22), 10 CONNECTOR (J2.6)
Ethernet_RX_P: 08 Ethernet (U6.23), 10 CONNECTOR (J2.4)
Ethernet_TX_N: 08 Ethernet (U6.20), 10 CONNECTOR (J2.5)
Ethernet_TX_P: 08 Ethernet (U6.21), 10 CONNECTOR (J2.3)
FMC_A0: 05 SDRAM (U2.H7), 04 MCU (U1.10)
FMC_A1: 05 SDRAM (U2.H8), 04 MCU (U1.11)
FMC_A2: 05 SDRAM (U2.J8), 04 MCU (U1.12)
FMC_A3: 05 SDRAM (U2.J7), 04 MCU (U1.13)
FMC_A4: 05 SDRAM (U2.J3), 04 MCU (U1.14)
FMC_A5: 05 SDRAM (U2.J2), 04 MCU (U1.15)
FMC_A6: 05 SDRAM (U2.H3), 04 MCU (U1.50)
FMC_A7: 05 SDRAM (U2.H2), 04 MCU (U1.53)
FMC_A8: 05 SDRAM (U2.H1), 04 MCU (U1.54)
FMC_A9: 05 SDRAM (U2.G3), 04 MCU (U1.55)
FMC_A10: 05 SDRAM (U2.H9), 04 MCU (U1.56)
FMC_A11: 05 SDRAM (U2.G2), 04 MCU (U1.57)
FMC_A14: 05 SDRAM (U2.G7), 04 MCU (U1.89)
FMC_A15: 05 SDRAM (U2.G8), 04 MCU (U1.90)
FMC_D0: 05 SDRAM (U2.A8), 04 MCU (U1.85)
FMC_D1: 05 SDRAM (U2.B9), 04 MCU (U1.86)
FMC_D2: 05 SDRAM (U2.B8), 04 MCU (U1.114)
FMC_D3: 05 SDRAM (U2.C9), 04 MCU (U1.115)
FMC_D4: 05 SDRAM (U2.C8), 04 MCU (U1.58)
FMC_D5: 05 SDRAM (U2.D9), 04 MCU (U1.59)
FMC_D6: 05 SDRAM (U2.D8), 04 MCU (U1.60)
FMC_D7: 05 SDRAM (U2.E9), 04 MCU (U1.63)
FMC_D8: 05 SDRAM (U2.E1), 04 MCU (U1.64)
FMC_D9: 05 SDRAM (U2.D2), 04 MCU (U1.65)
FMC_D10: 05 SDRAM (U2.D1), 04 MCU (U1.66)
FMC_D11: 05 SDRAM (U2.C2), 04 MCU (U1.67)
FMC_D12: 05 SDRAM (U2.C1), 04 MCU (U1.68)
FMC_D13: 05 SDRAM (U2.B2), 04 MCU (U1.77)
FMC_D14: 05 SDRAM (U2.B1), 04 MCU (U1.78)
FMC_D15: 05 SDRAM (U2.A2), 04 MCU (U1.79)
FMC_NBL0: 05 SDRAM (U2.E8), 04 MCU (U1.141)
FMC_NBL1: 05 SDRAM (U2.F1), 04 MCU (U1.142)
FMC_SDCKE0: 05 SDRAM (U2.F3), 04 MCU (U1.29)
FMC_SDCLK: 05 SDRAM (U2.F2), 04 MCU (U1.93)
FMC_SDNCAS: 05 SDRAM (U2.F7), 04 MCU (U1.132)
FMC_SDNE0: 05 SDRAM (U2.G9), 04 MCU (U1.28)
FMC_SDNRAS: 05 SDRAM (U2.F8), 04 MCU (U1.49)
FMC_SDNWE: 05 SDRAM (U2.F9), 04 MCU (U1.26)
I2C1_SCL: 07 Secure Element (R39.1 U5.6), 04 MCU (U1.136)
I2C1_SDA: 07 Secure Element (R38.1 U5.5), 04 MCU (U1.137)
I2C2_SCL: 04 MCU (U1.69), 10 CONNECTOR (J1.17 R40.1)
I2C2_SDA: 04 MCU (U1.70), 10 CONNECTOR (J1.15 R41.1)
PE2: 04 MCU (U1.1), 10 CONNECTOR (J1.6)
PE4: 04 MCU (U1.3), 10 CONNECTOR (J1.8)
PE5: 04 MCU (U1.4), 10 CONNECTOR (J1.10)
PE6: 04 MCU (U1.5), 10 CONNECTOR (J1.12)
RMII_RSTn: 08 Ethernet (C50.2 R23.2 U6.15), 04 MCU (U1.37)
SPI2_CE0: 04 MCU (U1.122), 10 CONNECTOR (J1.9)
SPI2_CE1: 04 MCU (U1.124), 10 CONNECTOR (J1.7)
SPI2_MISO: 04 MCU (U1.75), 10 CONNECTOR (J1.16)
SPI2_MOSI: 04 MCU (U1.76), 10 CONNECTOR (J1.18)
SPI2_SCK: 04 MCU (U1.117), 10 CONNECTOR (J1.11)
STM_NRST: 04 MCU (5 pins), 10 CONNECTOR (J2.26)
SYS_JTCK_SWCLK: 04 MCU (U1.109), 10 CONNECTOR (J2.18)
SYS_JTDI: 04 MCU (U1.110), 10 CONNECTOR (J2.20)
SYS_JTDO_SWO: 04 MCU (U1.133), 10 CONNECTOR (J2.22)
SYS_JTMS_SWDIO: 04 MCU (U1.105), 10 CONNECTOR (J2.16)
SYS_JTRST: 04 MCU (U1.134), 10 CONNECTOR (J2.24)
UART7_RX: 04 MCU (U1.18), 10 CONNECTOR (J1.29)
UART7_TX: 04 MCU (U1.19), 10 CONNECTOR (J1.31)

## Assembly variants
Manufacture: not fitted R5 R6